# EasyEDA Pro project Batterytester.epro, board PCB1
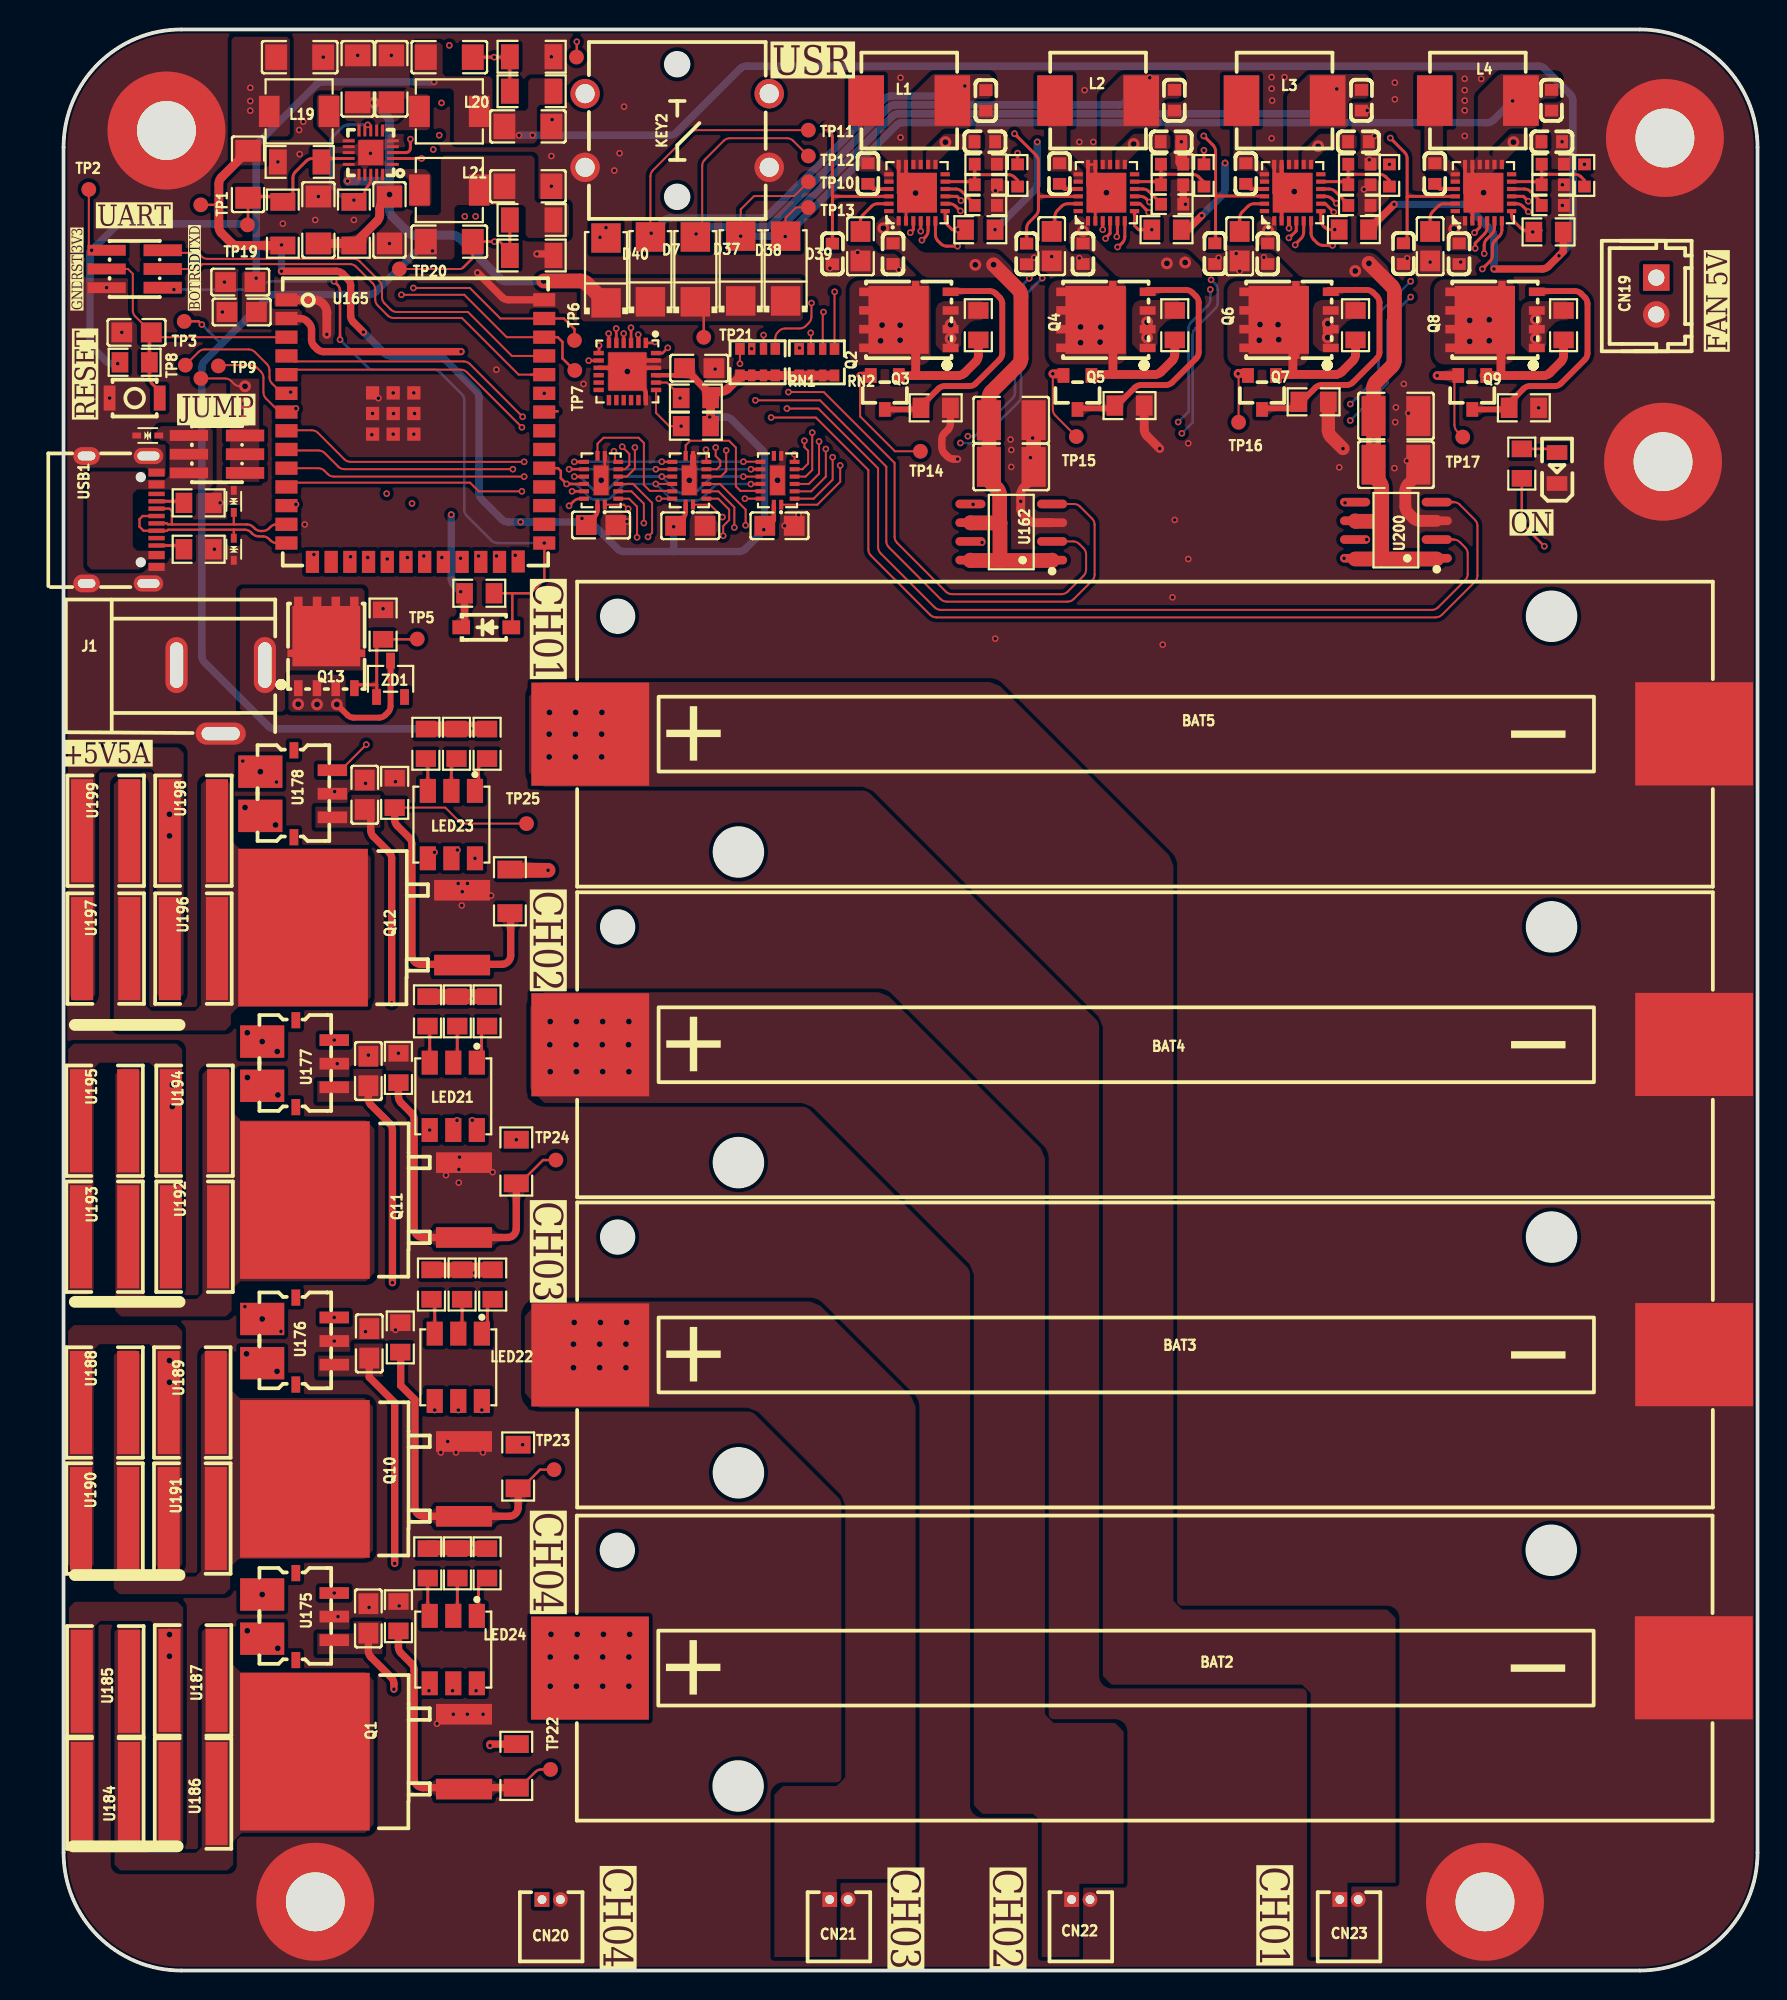
[diagram p1: board, top side]
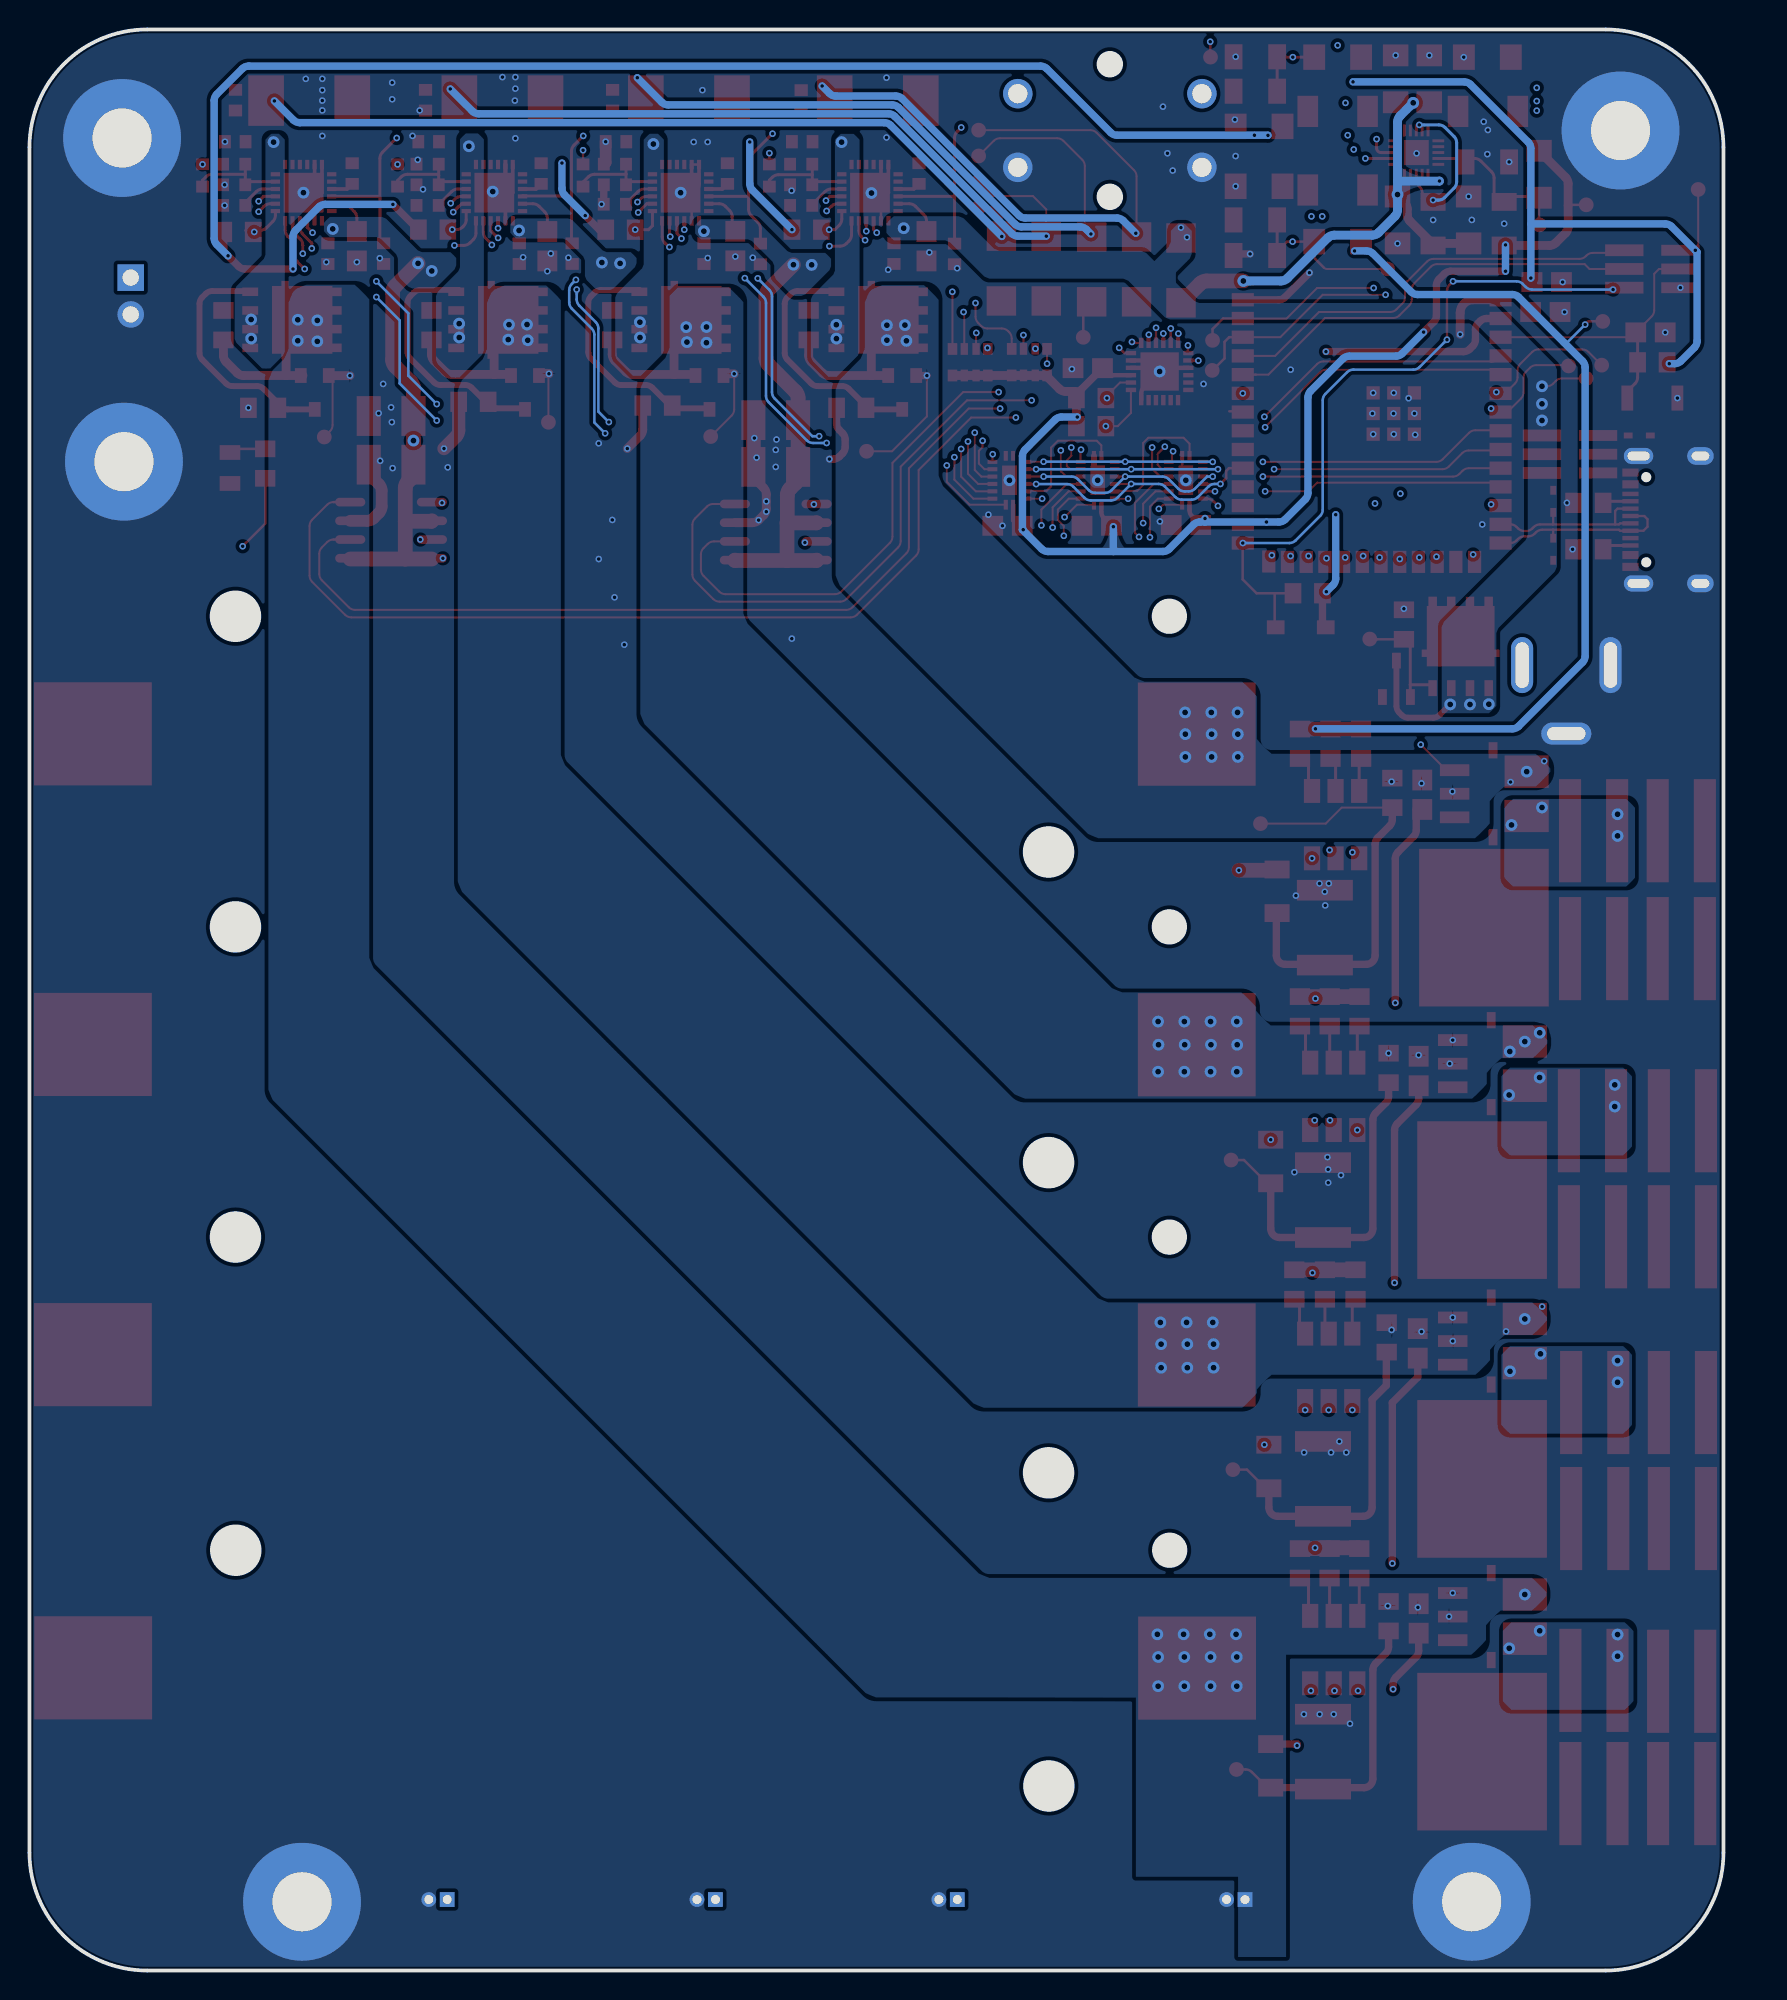
[diagram p2: board, bottom side, seen from below]

Outline 115 x 131.75 mm; copper layers: Top Layer, Inner1, Inner2, Bottom Layer. Coordinates in mm from the lower left corner of the outline.
Outline path: 0,123.75 0,8 arc(2.34,2.34) 8,0 107,0 arc(112.66,2.34) 115,8 115,123.75 arc(112.66,129.4) 107,131.75 8,131.75 arc(2.34,129.4) 0,123.75
Stack: Top Layer 0.035mm Outer layer thickness 1oz / Dielectric1 0.2104mm 7628 RC49% 8.6mil / Inner1 0.0152mm Inner layer thickness / Dielectric2 1.065mm 1.1mm H/HOZ Copper / Inner2 0.0152mm Inner layer thickness / Dielectric3 0.2104mm 7628 RC49% 8.6mil / Bottom Layer 0.035mm Outer layer thickness 1oz

## Design rules (mm)
net USB_D-: DP1
net USB_D+: DP1
template: Custom Config
spacing copperThickness1oz (default): track to track 0.102, other pairs 0.152 to 0.3
spacing copperThickness2oz: track to track 0.152, other pairs 0.152 to 0.3
track width copperThickness1oz (default): min 0.135, default 0.17, max 2.54
track width copperThickness2oz: min 0.135, default 0.17, max 2.54
differential pair differentialPair (default): width min 0.157, default 0.157, max 0.157; gap min 0.203, default 0.203
via viaSize (default): diameter min 0.399, default 0.45, max 10; hole min 0.249, default 0.249, max 6.299

## Placement (name value [footprint] x y rotation side)
BAT2  1042  [BAT-SMD_1042P]  73.39 20.53 180 top
BAT3  1042  [BAT-SMD_1042P]  73.41 41.78 180 top
BAT4  1042  [BAT-SMD_1042P]  73.41 62.84 180 top
BAT5  1042  [BAT-SMD_1042P]  73.41 83.92 180 top
BQ25896  BQ25896RTWR  [QFN-24_L4.0-W4.0-P0.50-TL-EP2.7]  57.94 120.67 90 top
BQ25897  BQ25896RTWR  [QFN-24_L4.0-W4.0-P0.50-TL-EP2.7]  70.8 120.67 90 top
BQ25898  BQ25896RTWR  [QFN-24_L4.0-W4.0-P0.50-TL-EP2.7]  83.44 120.67 90 top
BQ25899  BQ25896RTWR  [QFN-24_L4.0-W4.0-P0.50-TL-EP2.7]  96.39 120.67 90 top
C4  220pF  [C1206]  12.52 121.92 90 top
C5  220pF  [C1206]  26.19 129.87 180 top
C24  47nF  [C0603]  54.61 121.97 90 top
C25  22uF  [C0603]  62.61 126.93 90 top
C26  10uF  [C0603]  62.54 124.13 180 top
C27  1uF  [C0603]  56.31 116.53 90 top
C28  4.7uF  [C0603]  52.2 116.51 270 top
C29  47uF  [C0805]  54.1 117.03 90 top
C247  100nF  [C1210]  64.34 102.05 180 top
C248  10uF  [C1210]  64.34 105.23 180 top
C254  10uF  [C1206]  22.12 118.82 90 top
C257  10uF  [C1206]  17.3 118.82 270 top
C364  47nF  [C0603]  67.62 121.97 90 top
C365  22uF  [C0603]  75.41 126.95 90 top
C366  10uF  [C0603]  75.18 124.13 180 top
C367  1uF  [C0603]  69.21 116.53 90 top
C368  4.7uF  [C0603]  65.38 116.51 270 top
C369  47uF  [C0805]  67.08 117.04 90 top
C370  47nF  [C0603]  80.26 121.97 90 top
C371  22uF  [C0603]  88.11 126.95 90 top
C372  10uF  [C0603]  87.9 124.13 180 top
C373  1uF  [C0603]  81.75 116.53 90 top
C374  4.7uF  [C0603]  78.16 116.53 270 top
C375  47uF  [C0805]  79.84 117.03 90 top
C376  47nF  [C0603]  93.09 121.97 90 top
C377  22uF  [C0603]  101.02 126.95 90 top
C378  10uF  [C0603]  101.03 124.13 180 top
C379  1uF  [C0603]  94.74 116.53 90 top
C380  4.7uF  [C0603]  90.96 116.53 270 top
C381  47uF  [C0805]  92.77 117.03 90 top
C390  10uF  [C1206]  22.25 128.4 270 top
C391  10uF  [C1206]  16.03 129.87 180 top
C392  10uF  [C1206]  31.52 125.17 180 top
C393  10uF  [C1206]  19.97 128.4 270 top
C394  220pF  [C1206]  26.19 117.35 180 top
C395  10uF  [C1206]  31.52 121.1 180 top
C396  100nF  [C0805]  43.15 108.76 180 top
C397  100nF  [C0805]  36.49 98.11 0 top
C398  100nF  [C0805]  20.45 79.8 90 top
C399  100nF  [C0805]  20.69 61.05 270 top
C400  100nF  [C0805]  20.75 42.57 270 top
C401  100nF  [C0805]  20.69 23.9 270 top
C402  100nF  [C0805]  12 114.6 0 top
C403  100nF  [C0805]  4.95 111.19 0 top
C405  100nF  [C0805]  48.6 98.06 0 top
C406  100nF  [C0805]  42.55 98.06 0 top
C407  1uF  [C0805]  12.09 112.57 0 top
C408  100nF  [C1210]  90.45 102.21 180 top
C409  10uF  [C1210]  90.45 105.51 180 top
CN19  ZX-XH2.54-2PZZ  [CONN-TH_2P-P2.50_HX25003-2A]  108.13 113.65 270 top
CN20  HC-1.25-2AW  [CONN-TH_2P-P1.25_HCTL_HC-1.25-2AW]  33.1 4.82 0 top
CN21  HC-1.25-2AW  [CONN-TH_2P-P1.25_HCTL_HC-1.25-2AW]  52.64 4.82 0 top
CN22  HC-1.25-2AW  [CONN-TH_2P-P1.25_HCTL_HC-1.25-2AW]  69.06 4.82 0 top
CN23  HC-1.25-2AW  [CONN-TH_2P-P1.25_HCTL_HC-1.25-2AW]  87.27 4.82 0 top
D7  SS34  [SMA_L4.3-W2.6-LS5.2-RD]  39.84 115.46 90 top
D8  1N4148W-7-F  [SOD-123_L2.7-W1.6-LS3.7-RD-1]  28.7 91.17 0 top
D27  LESD5D5.0CT1G  [SOD-523_L1.2-W0.8-LS1.6-BI]  11.56 99.72 270 top
D28  LESD5D5.0CT1G  [SOD-523_L1.2-W0.8-LS1.6-BI]  5.71 104.19 0 top
D29  LESD5D5.0CT1G  [SOD-523_L1.2-W0.8-LS1.6-BI]  11.56 96.47 90 top
D37  SS34  [SMA_L4.3-W2.6-LS5.2-RD]  42.89 115.46 90 top
D38  SS34  [SMA_L4.3-W2.6-LS5.2-RD]  45.97 115.52 90 top
D39  SS34  [SMA_L4.3-W2.6-LS5.2-RD]  49.02 115.52 90 top
D40  SS34  [SMA_L4.3-W2.6-LS5.2-RD]  36.83 115.39 90 top
J1  DC005-T25  [DC-IN-TH_DC-005-20A-1]  10.67 86.28 0 top
KEY2  B3F-4055  [KEY-TH_4P-L12.0-W12.0-P5.00-LS13.4-EH]  41.66 124.89 0 top
L1  1.5uH  [IND-SMD_L6.5-W6.5_VISHAY]  57.41 126.92 0 top
L2  1.5uH  [IND-SMD_L6.5-W6.5_VISHAY]  70.23 126.92 0 top
L3  1.5uH  [IND-SMD_L6.5-W6.5_VISHAY]  82.89 126.92 0 top
L4  1.5uH  [IND-SMD_L6.5-W6.5_VISHAY]  96.01 126.92 0 top
L19  1.5uH  [IND-SMD_L4.4-W4.2]  15.99 126.18 0 top
L20  1.5uH  [IND-SMD_L4.4-W4.2]  26.19 126.18 180 top
L21  1.5uH  [IND-SMD_L4.4-W4.2]  26.19 120.85 180 top
LED21  HL-AF-5060H271BU46FU79GC-S1-THL  [LED-ARRAY-SMD_6P-L5.4-W5.0-TL-FD]  26.46 59.33 270 top
LED22  HL-AF-5060H271BU46FU79GC-S1-THL  [LED-ARRAY-SMD_6P-L5.4-W5.0-TL-FD]  26.8 40.94 270 top
LED23  HL-AF-5060H271BU46FU79GC-S1-THL  [LED-ARRAY-SMD_6P-L5.4-W5.0-TL-FD]  26.33 77.78 270 top
LED24  HL-AF-5060H271BU46FU79GC-S1-THL  [LED-ARRAY-SMD_6P-L5.4-W5.0-TL-FD]  26.46 21.78 270 top
LED25  NCD0805R1  [LED0805-R-RD]  101.39 101.98 90 top
NOREF  -  [Pad_e204]  108.59 102.41 0 top
NOREF#2  -  [Pad_e203]  108.71 124.38 0 top
NOREF#3  -  [Pad_e202]  17.09 4.67 0 top
NOREF#4  -  [Pad_e206]  96.5 4.67 0 top
NOREF#5  -  [Pad_e200]  6.98 124.89 0 top
Q1  IRLZ44NSTRR-VB  [TO-263-3_L10.2-W9.2-P5.08-LS15.4-BR]  21.78 14.85 0 top
Q2  SI7137DP-T1-GE3  [DFN-8_L5.1-W5.7-P1.27-LS6.1-BL]  57.38 112.04 90 top
Q3  DMP2100U-7  [SOT-23_L2.9-W1.3-P1.90-LS2.4-BR]  55.75 107.11 90 top
Q4  SI7137DP-T1-GE3  [DFN-8_L5.1-W5.7-P1.27-LS6.1-BL]  70.76 112.04 90 top
Q5  DMP2100U-7  [SOT-23_L2.9-W1.3-P1.90-LS2.4-BR]  68.83 107.11 90 top
Q6  SI7137DP-T1-GE3  [DFN-8_L5.1-W5.7-P1.27-LS6.1-BL]  83.19 112.04 90 top
Q7  DMP2100U-7  [SOT-23_L2.9-W1.3-P1.90-LS2.4-BR]  81.36 107.11 90 top
Q8  SI7137DP-T1-GE3  [DFN-8_L5.1-W5.7-P1.27-LS6.1-BL]  97.18 112.04 90 top
Q9  DMP2100U-7  [SOT-23_L2.9-W1.3-P1.90-LS2.4-BR]  95.63 107.11 90 top
Q10  IRLZ44NSTRR-VB  [TO-263-3_L10.2-W9.2-P5.08-LS15.4-BR]  21.78 33.37 0 top
Q11  IRLZ44NSTRR-VB  [TO-263-3_L10.2-W9.2-P5.08-LS15.4-BR]  21.78 52.29 0 top
Q12  IRLZ44NSTRR-VB  [TO-263-3_L10.2-W9.2-P5.08-LS15.4-BR]  21.66 70.78 0 top
Q13  SI7137DP-T1-GE3  [DFN-8_L5.1-W5.7-P1.27-LS6.1-BL]  17.84 89.87 0 top
R23  5.23kΩ  [R0603]  64.77 121.84 90 top
R24  30.1kΩ  [R0603]  62.61 121.2 0 top
R25  NTCG163JF103FT1  [R0603]  62.61 122.6 180 top
R26  124Ω  [R0603]  62.61 119.8 180 top
R194  68kΩ  [R1206]  14.89 118.56 270 top
R195  15kΩ  [R1206]  16.03 122.75 180 top
R196  68kΩ  [R1206]  31.78 127.55 0 top
R197  15kΩ  [R1206]  31.78 129.89 0 top
R280  5.23kΩ  [R0603]  77.42 121.84 90 top
R281  30.1kΩ  [R0603]  75.25 122.6 0 top
R282  NTCG163JF103FT1  [R0603]  75.25 121.2 180 top
R283  124Ω  [R0603]  75.26 119.88 180 top
R285  5.23kΩ  [R0603]  90.01 121.84 90 top
R286  30.1kΩ  [R0603]  87.97 121.2 0 top
R287  NTCG163JF103FT1  [R0603]  87.97 122.6 180 top
R288  124Ω  [R0603]  87.97 119.8 180 top
R290  5.23kΩ  [R0603]  103.25 121.84 90 top
R291  30.1kΩ  [R0603]  101.1 121.2 0 top
R292  NTCG163JF103FT1  [R0603]  101.1 122.6 180 top
R293  124Ω  [R0603]  101.1 119.8 180 top
R320  68kΩ  [R1206]  31.78 118.82 0 top
R321  15kΩ  [R1206]  31.78 116.41 0 top
R322  68kΩ  [R1206]  19.71 118.56 270 top
R324  100kΩ  [R0805]  59.21 106.07 180 top
R325  100kΩ  [R0805]  62.1 111.67 90 top
R326  100kΩ  [R0805]  72.36 106.22 180 top
R327  100kΩ  [R0805]  75.44 111.67 90 top
R328  100kΩ  [R0805]  84.86 106.47 180 top
R329  100kΩ  [R0805]  87.71 111.67 90 top
R330  100kΩ  [R0805]  99.14 106.07 180 top
R331  100kΩ  [R0805]  101.83 111.67 90 top
R337  100kΩ  [R0805]  62.23 118.16 0 top
R338  100kΩ  [R0805]  74.88 118.16 0 top
R339  100kΩ  [R0805]  87.59 118.16 0 top
R340  100kΩ  [R0805]  100.81 118 0 top
R341  100kΩ  [R0805]  22.48 79.93 90 top
R342  100kΩ  [R0805]  22.73 24.05 90 top
R343  100kΩ  [R0805]  22.86 42.97 90 top
R344  100kΩ  [R0805]  22.73 61.26 90 top
R346  100kΩ  [R0805]  4.83 109.15 0 top
R347  100kΩ  [R0805]  28.22 93.48 0 top
R348  300Ω  [R0805]  24.71 65.1 90 top
R349  300Ω  [R0805]  26.73 65.1 90 top
R350  300Ω  [R0805]  28.75 65.1 90 top
R351  300Ω  [R0805]  24.98 46.56 90 top
R352  300Ω  [R0805]  27.05 46.56 90 top
R353  300Ω  [R0805]  29.13 46.56 90 top
R354  300Ω  [R0805]  24.6 83.26 90 top
R355  300Ω  [R0805]  26.67 83.26 90 top
R356  300Ω  [R0805]  28.75 83.26 90 top
R357  300Ω  [R0805]  24.72 27.64 90 top
R358  300Ω  [R0805]  26.74 27.64 90 top
R359  300Ω  [R0805]  28.75 27.64 90 top
R360  5.1kΩ  [R0805]  9.17 99.61 180 top
R361  5.1kΩ  [R0805]  9.17 96.47 180 top
R362  2.2kΩ  [R0805]  42.93 106.73 0 top
R363  2.2kΩ  [R0805]  42.93 104.82 0 top
R364  300Ω  [R0805]  21.69 91.36 270 top
R370  20Ω  [R1206]  30.73 13.89 270 top
R371  20Ω  [R1206]  30.86 34.21 270 top
R372  20Ω  [R1206]  30.73 54.91 270 top
R373  20Ω  [R1206]  30.3 73.25 270 top
R374  1kΩ  [R0805]  99 102.28 270 top
RN1  2.2kΩ  [RES-ARRAY-SMD_0603-8P-L3.2-W1.6-BL]  47.12 109.17 180 top
RN2  2.2kΩ  [RES-ARRAY-SMD_0603-8P-L3.2-W1.6-BL]  51.14 109.16 180 top
SW3  TS-3025-B-C-B  [SW-SMD_L3.0-W2.5-P3.40-LS4.0-L]  4.83 106.73 180 top
TP1  -  [TESTPOINT-SMD_BD2.0-H10.5]  9.31 119.84 0 top
TP2  -  [TESTPOINT-SMD_BD2.0-H10.5]  1.71 120.89 0 top
TP3  -  [TESTPOINT-SMD_BD2.0-H10.5]  8.19 111.93 0 top
TP4  -  [TESTPOINT-SMD_BD2.0-H10.5]  9.32 108.06 0 top
TP5  -  [TESTPOINT-SMD_BD2.0-H10.5]  24.01 90.37 0 top
TP6  -  [TESTPOINT-SMD_BD2.0-H10.5]  34.68 110.64 0 top
TP7  -  [TESTPOINT-SMD_BD2.0-H10.5]  34.71 108.6 0 top
TP8  -  [TESTPOINT-SMD_BD2.0-H10.5]  8.27 108.96 0 top
TP9  -  [TESTPOINT-SMD_BD2.0-H10.5]  10.51 108.91 0 top
TP10  -  [TESTPOINT-SMD_BD2.0-H10.5]  50.56 121.41 0 top
TP11  -  [TESTPOINT-SMD_BD2.0-H10.5]  50.56 124.91 0 top
TP12  -  [TESTPOINT-SMD_BD2.0-H10.5]  50.56 123.16 0 top
TP13  -  [TESTPOINT-SMD_BD2.0-H10.5]  50.56 119.66 0 top
TP14  -  [TESTPOINT-SMD_BD2.0-H10.5]  58.17 103.12 0 top
TP15  -  [TESTPOINT-SMD_BD2.0-H10.5]  68.75 104.12 0 top
TP16  -  [TESTPOINT-SMD_BD2.0-H10.5]  79.77 105.09 0 top
TP17  -  [TESTPOINT-SMD_BD2.0-H10.5]  94.99 104.08 0 top
TP18  -  [TESTPOINT-SMD_BD2.0-H10.5]  34.82 129.87 0 top
TP19  -  [TESTPOINT-SMD_BD2.0-H10.5]  12.49 118.48 0 top
TP20  -  [TESTPOINT-SMD_BD2.0-H10.5]  22.8 115.49 0 top
TP21  -  [TESTPOINT-SMD_BD2.0-H10.5]  43.46 110.85 0 top
TP22  -  [TESTPOINT-SMD_BD2.0-H10.5]  33.06 13.65 0 top
TP23  -  [TESTPOINT-SMD_BD2.0-H10.5]  33.3 34 0 top
TP24  -  [TESTPOINT-SMD_BD2.0-H10.5]  33.42 55.01 0 top
TP25  -  [TESTPOINT-SMD_BD2.0-H10.5]  31.43 77.84 0 top
U9  EA3036CQBR  [WQFN-20_L3.0-W3.0-P0.40-BL-EP]  20.85 123.39 90 top
U162  UCC27524ADR  [SOIC-8_L4.9-W3.9-P1.27-LS6.0-BL]  64.34 97.63 90 top
U165  ESP32-S3-WROOM-1U-N16R8  [WIRELM-SMD_ESP32-S3-WROOM-1U]  23.88 104.5 0 top
U175  ACS781LLRTR-100B-T  [PSOF-7_L6.4-W4.8-BL]  15.93 24.02 90 top
U176  ACS781LLRTR-100B-T  [PSOF-7_L6.4-W4.8-BL]  15.93 42.72 90 top
U177  ACS781LLRTR-100B-T  [PSOF-7_L6.4-W4.8-BL]  15.93 61.55 90 top
U178  ACS781LLRTR-100B-T  [PSOF-7_L6.4-W4.8-BL]  15.8 79.87 90 top
U179  TCA9548ARGER  [VQFN-24_L4.0-W4.0-P0.50-BL-EP2.5]  38.28 108.53 180 top
U181  74HC595BQ,115  [DHVQFN-16_L3.5-W2.5-P0.50-BL-EP]  36.5 101.15 90 top
U182  74HC595BQ,115  [DHVQFN-16_L3.5-W2.5-P0.50-BL-EP]  42.48 101.15 90 top
U183  74HC595BQ,115  [DHVQFN-16_L3.5-W2.5-P0.50-BL-EP]  48.47 101.15 90 top
U184  8Ω  [R1225]  2.84 12.01 180 top
U185  8Ω  [R1225]  2.84 19.63 180 top
U186  8Ω  [R1225]  8.79 12.01 180 top
U187  8Ω  [R1225]  8.79 19.7 180 top
U188  8Ω  [R1225]  2.78 38.55 180 top
U189  8Ω  [R1225]  8.74 38.55 180 top
U190  8Ω  [R1225]  2.78 30.68 180 top
U191  8Ω  [R1225]  8.74 30.68 180 top
U192  8Ω  [R1225]  8.89 49.8 180 top
U193  8Ω  [R1225]  2.78 49.8 180 top
U194  8Ω  [R1225]  8.89 57.68 180 top
U195  8Ω  [R1225]  2.78 57.68 180 top
U196  8Ω  [R1225]  8.81 69.36 180 top
U197  8Ω  [R1225]  2.86 69.36 180 top
U198  8Ω  [R1225]  8.81 77.36 180 top
U199  8Ω  [R1225]  2.86 77.36 180 top
U200  UCC27524ADR  [SOIC-8_L4.9-W3.9-P1.27-LS6.0-BL]  90.45 97.76 90 top
UART1  20021121-00006C4LF  [HDR-SMD_6P-P1.27-V-M-R2-C3-S1.27-LS5.5]  10.41 102.92 270 top
UART2  20021121-00006C4LF  [HDR-SMD_6P-P1.27-V-M-R2-C3-S1.27-LS5.5]  4.83 115.49 270 top
USB1  TYPE-C 16PIN 2MD(073)  [USB-C-SMD_TYPE-C-6PIN-2MD-073]  3.94 98.47 270 top
ZD1  LBZX84C6V2LT1G  [SOT-23-3_L2.9-W1.6-P1.90-LS2.8-BR]  22.2 87.67 270 top

## Footprints (pads in the part's own frame, mm; a bottom-side part is the same pattern mirrored in y, then rotated)
BAT-SMD_1042P
  rect 8x7 smd: 1(-37.28,-0.02) 2(37.66,0)
C0603
  rect 0.8x0.9 smd: 1(-0.7,0) 2(0.7,0)
C0805
  rect 1.41x1.35 smd: 1(-1,0) 2(1,0)
C1206
  rect 1.485x1.728 smd: 1(-1.593,0) 2(1.593,0)
C1210
  rect 1.635x2.7 smd: 1(-1.518,0) 2(1.518,0)
CONN-TH_2P-P1.25_HCTL_HC-1.25-2AW
  rect 1x1 hole 0.6: 1(-0.625,0)
  round 1 hole 0.6: 2(0.625,0)
CONN-TH_2P-P2.50_HX25003-2A
  rect 1.8x1.8 hole 1.1: 1(-1.25,0)
  round 1.8 hole 1.1: 2(1.25,0)
DC-IN-TH_DC-005-20A-1
  oval 1.5x3.8 hole 0.9x3.1: 1(3,2.325) 2(-3,2.325)
  oval 3.4x1.5 hole 2.6x0.9: 3(0,-2.325)
DFN-8_L5.1-W5.7-P1.27-LS6.1-BL
  rect 0.58x1.079 smd: 1(-1.905,-2.834) 2(-0.635,-2.834) 3(0.635,-2.834) 4(1.905,-2.834)
  rect 0.58x1.08 smd: 5(1.9,2.834) 6(0.64,2.834) 7(-0.63,2.834) 8(-1.9,2.834)
  rect 0.95x0.5 smd: 9(-2.169,-0.465) 9(2.169,-0.465)
  rect 4.6x4.1 smd: 9(0,0.695)
DHVQFN-16_L3.5-W2.5-P0.50-BL-EP
  rect 0.665x0.28 smd: 1(-1.657,-0.25) 8(1.657,-0.25) 9(1.657,0.25) 16(-1.657,0.25)
  rect 0.28x0.665 smd: 2(-1.25,-1.157) 3(-0.75,-1.157) 4(-0.25,-1.157) 5(0.25,-1.157) 6(0.75,-1.157) 7(1.25,-1.157) 10(1.25,1.157) 11(0.75,1.157) 12(0.25,1.157) 13(-0.25,1.157) 14(-0.75,1.157) 15(-1.25,1.157)
  rect 2x1 smd: 17(0,0)
HDR-SMD_6P-P1.27-V-M-R2-C3-S1.27-LS5.5
  rect 0.739x2.601 smd: 1(-1.27,-1.905) 3(0,-1.905) 5(1.27,-1.905)
  rect 0.8x2.601 smd: 2(-1.27,1.905) 4(0,1.905) 6(1.27,1.905)
IND-SMD_L4.4-W4.2
  rect 1.4x2.12 smd: 1(2.028,0) 2(-2.028,0)
IND-SMD_L6.5-W6.5_VISHAY
  rect 2.42x3.43 smd: 1(-2.925,0) 2(2.925,0)
KEY-TH_4P-L12.0-W12.0-P5.00-LS13.4-EH
  round 2 hole 1.3: 1(6.25,-2.5) 2(-6.25,-2.5) 3(6.25,2.5) 4(-6.25,2.5)
LED0805-R-RD
  rect 1x1.399 smd: 1(1.05,0) 2(-1.05,0)
LED-ARRAY-SMD_6P-L5.4-W5.0-TL-FD
  rect 1.625x1.1 smd: 1(-2.288,1.6) 2(-2.288,0) 3(-2.288,-1.6) 4(2.288,-1.6) 5(2.288,0) 6(2.288,1.6)
Pad_e200
  round 8 hole 4: 1(0,0)
Pad_e202
  round 8 hole 4: 1(0,0)
Pad_e203
  round 8 hole 4: 1(0,0)
Pad_e204
  round 8 hole 4: 1(0,0)
Pad_e206
  round 8 hole 4: 1(0,0)
PSOF-7_L6.4-W4.8-BL
  rect 0.8x2 smd: 1(-1.601,-2.446) 2(0,-2.446) 3(1.6,-2.446)
  rect 1.1x0.6 smd: 4(2.95,0.164) 7(-2.95,0.164)
  rect 2.2x3 smd: 5(1.5,2.446) 6(-1.5,2.446)
QFN-24_L4.0-W4.0-P0.50-TL-EP2.7
  rect 0.633x0.28 smd: 1(-1.911,1.25) 2(-1.911,0.75) 3(-1.911,0.25) 4(-1.911,-0.25) 5(-1.911,-0.75) 6(-1.911,-1.25) 13(1.911,-1.25) 14(1.911,-0.75) 15(1.911,-0.25) 16(1.911,0.25) 17(1.911,0.75) 18(1.911,1.25)
  rect 0.28x0.633 smd: 7(-1.25,-1.911) 8(-0.75,-1.911) 9(-0.25,-1.911) 10(0.25,-1.911) 11(0.75,-1.911) 12(1.25,-1.911) 19(1.25,1.911) 20(0.75,1.911) 21(0.25,1.911) 22(-0.25,1.911) 23(-0.75,1.911) 24(-1.25,1.911)
  rect 2.7x2.7 smd: 25(0,0)
R0603
  rect 0.806x0.864 smd: 1(-0.753,0) 2(0.753,0)
R0805
  rect 1.133x1.377 smd: 1(-1,0) 2(1,0)
R1206
  rect 1.208x1.701 smd: 1(-1.479,0) 2(1.479,0)
R1225
  rect 1.5x7 smd: 1(-1.6,0) 2(1.6,0)
RES-ARRAY-SMD_0603-8P-L3.2-W1.6-BL
  rect 0.65x0.8 smd: 1(-1.2,-0.9) 4(1.2,-0.9) 5(1.2,0.9) 8(-1.2,0.9)
  rect 0.5x0.8 smd: 2(-0.4,-0.9) 3(0.4,-0.9) 6(0.4,0.9) 7(-0.4,0.9)
SMA_L4.3-W2.6-LS5.2-RD
  rect 2x2 smd: 1(-2.2,0) 2(2.2,0)
SOD-123_L2.7-W1.6-LS3.7-RD-1
  rect 1.2x0.95 smd: 1(-1.7,0) 2(1.7,0)
SOD-523_L1.2-W0.8-LS1.6-BI
  rect 0.6x0.4 smd: 1(-0.75,0) 2(0.75,0)
SOIC-8_L4.9-W3.9-P1.27-LS6.0-BL
  oval 0.588x2.045 smd: 1(-1.905,-2.772) 2(-0.635,-2.772) 3(0.635,-2.772) 4(1.905,-2.772) 5(1.905,2.772) 6(0.635,2.772) 7(-0.635,2.772) 8(-1.905,2.772)
SOT-23-3_L2.9-W1.6-P1.90-LS2.8-BR
  rect 1.07x0.6 smd: 1(1.235,-0.95) 2(1.235,0.95) 3(-1.235,0)
SOT-23_L2.9-W1.3-P1.90-LS2.4-BR
  rect 1x0.8 smd: 1(1.15,-0.95) 2(1.15,0.95) 3(-1.15,0)
SW-SMD_L3.0-W2.5-P3.40-LS4.0-L
  rect 0.8x1.7 smd: 1(-1.7,0) 2(1.7,0)
TESTPOINT-SMD_BD2.0-H10.5
  round 1 smd: 1(0,0)
TO-263-3_L10.2-W9.2-P5.08-LS15.4-BR
  rect 3.8x1.4 smd: 1(5.4,-2.54) 3(5.4,2.54)
  rect 8.8x10.7 smd: 2(-5.4,0)
USB-C-SMD_TYPE-C-6PIN-2MD-073
  rect 0.55x1.1 smd: 1(-3.2,2.375) 2(-2.4,2.375) 11(2.4,2.375) 12(3.2,2.375)
  rect 0.3x1.1 smd: 3(-1.75,2.375) 4(-1.25,2.375) 5(-0.75,2.375) 6(-0.25,2.375) 7(0.25,2.375) 8(0.75,2.375) 9(1.25,2.375) 10(1.75,2.375)
  oval 1.1x2 hole 0.6x1.5: 13(-4.325,1.825) 14(4.325,1.825)
  oval 1.2x1.8 hole 0.6x1.2: 13(-4.325,-2.375) 14(4.325,-2.375)
VQFN-24_L4.0-W4.0-P0.50-BL-EP2.5
  rect 0.3x0.7 smd: 1(-1.25,-1.942) 2(-0.75,-1.942) 3(-0.25,-1.942) 4(0.25,-1.942) 5(0.75,-1.942) 6(1.25,-1.942) 13(1.25,1.942) 14(0.75,1.942) 15(0.25,1.942) 16(-0.25,1.942) 17(-0.75,1.942) 18(-1.25,1.942)
  rect 0.7x0.3 smd: 7(1.948,-1.25) 8(1.948,-0.75) 9(1.948,-0.25) 10(1.948,0.25) 11(1.948,0.75) 12(1.948,1.25) 19(-1.948,1.25) 20(-1.948,0.75) 21(-1.948,0.25) 22(-1.948,-0.25) 23(-1.948,-0.75) 24(-1.948,-1.25)
  rect 2.6x2.6 smd: 25(0.001,-0.001)
WIRELM-SMD_ESP32-S3-WROOM-1U
  rect 1.5x0.9 smd: 1(-8.75,8.895) 2(-8.75,7.625) 3(-8.75,6.355) 4(-8.75,5.085) 5(-8.75,3.815) 6(-8.75,2.545) 7(-8.75,1.275) 8(-8.75,0.005) 9(-8.75,-1.265) 10(-8.75,-2.535) 11(-8.75,-3.805) 12(-8.75,-5.075) 13(-8.75,-6.345) 14(-8.75,-7.615) 27(8.75,-7.615) 28(8.75,-6.345) 29(8.75,-5.075) 30(8.75,-3.805) 31(8.75,-2.535) 32(8.75,-1.265) 33(8.75,0.005) 34(8.75,1.275) 35(8.75,2.545) 36(8.75,3.815) 37(8.75,5.085) 38(8.75,6.355) 39(8.75,7.625) 40(8.75,8.895)
  rect 0.9x1.5 smd: 15(-6.985,-8.895) 16(-5.715,-8.895) 17(-4.445,-8.895) 18(-3.175,-8.895) 19(-1.905,-8.895) 20(-0.635,-8.895) 21(0.635,-8.895) 22(1.905,-8.895) 23(3.175,-8.895) 24(4.445,-8.895) 25(5.715,-8.895) 26(6.985,-8.865)
  rect 0.9x0.9 smd: 41(-2.9,2.575) 41(-2.9,1.175) 41(-2.9,-0.225) 41(-1.5,2.575) 41(-1.5,1.175) 41(-1.5,-0.225) 41(-0.1,2.575) 41(-0.1,1.175) 41(-0.1,-0.225)
WQFN-20_L3.0-W3.0-P0.40-BL-EP
  rect 0.2x0.8 smd: 1(-0.8,-1.5) 2(-0.4,-1.5) 3(0,-1.5) 4(0.4,-1.5) 5(0.8,-1.5) 11(0.8,1.5) 12(0.4,1.5) 13(0,1.5) 14(-0.4,1.5) 15(-0.8,1.5)
  rect 0.8x0.2 smd: 6(1.5,-0.8) 7(1.5,-0.4) 8(1.5,0) 9(1.5,0.4) 10(1.5,0.8) 16(-1.5,0.8) 17(-1.5,0.4) 18(-1.5,0.001) 19(-1.5,-0.4) 20(-1.5,-0.8)
  rect 1.7x1.7 smd: 21(0,0)

## Nets
As in the schematic, except:
GND: BAT2.1 BAT3.1 BAT4.1 BAT5.1 BQ25896.2 BQ25896.17 BQ25896.18 BQ25896.25 BQ25897.2 BQ25897.17 BQ25897.18 BQ25897.25 BQ25898.2 BQ25898.17 BQ25898.18 BQ25898.25 BQ25899.2 BQ25899.17 BQ25899.18 BQ25899.25 C25.1 C26.1 C27.1 C28.2 C29.1 C247.1 C248.1 C254.1 C257.1 C365.1 C366.1 C367.1 C368.2 C369.1 C371.1 C372.1 C373.1 C374.2 C375.1 C377.1 C378.1 C379.1 C380.2 C381.1 C390.1 C391.1 C392.1 C393.1 C395.1 C396.1 C397.2 C398.2 C399.1 C400.1 C401.1 C402.1 C403.1 C405.2 C406.2 C407.1 C408.1 C409.1 CN19.2 CN20.2 CN21.2 CN22.2 CN23.2 D27.1 D28.1 D29.1 J1.2 J1.3 KEY2.1 KEY2.2 LED25.2 NOREF.1 NOREF#2.1 NOREF#3.1 NOREF#4.1 NOREF#5.1 Q1.3 Q10.3 Q11.3 Q12.3 R24.2 R25.1 R26.1 R195.2 R197.2 R281.2 R282.1 R283.1 R286.2 R287.1 R288.1 R291.2 R292.1 R293.1 R321.2 R324.1 R326.1 R328.1 R330.1 R341.2 R342.2 R343.2 R344.2 R360.1 R361.1 R364.1 SW3.2 U9.1 U9.4 U9.5 U9.12 U9.13 U9.15 U9.17 U9.21 U162.3 U165.1 U165.40 U165.41 U175.2 U176.2 U177.2 U178.2 U179.9 U179.18 U179.22 U179.23 U179.25 U181.8 U181.17 U182.8 U182.17 U183.8 U183.17 U200.3 UART2.5 USB1.1 USB1.12 USB1.13 USB1.14

Pads without a net: BQ25896 12 24; BQ25897 12 24; BQ25898 12 24; BQ25899 12 24; U165 16 28 29 30 32 33 34; U175 4 7; U176 4 7; U177 4 7; U178 4 7; U179 10 11 12 13 14 15 16 17; U183 9; USB1 3 9; ZD1 2

## Via types
v1: diameter 0.45, hole 0.25, Top Layer to Bottom Layer, 375 vias
v2: diameter 0.8, hole 0.4, Top Layer to Bottom Layer, 120 vias

## Routing (per net, layer and track width the routed paths; a pad name or vN(x,y) marks a point on that pad's centre or on a via; arc(x,y) is an arc through that point)
+3V3A: length 227
  Top Layer w0.17: TP1.1 10.5,119.84 10.54,119.8
  Top Layer w0.3: U183.16 48.22,98.42 48.17,98.42 v1(47.54,97.79) ; U181.16 36.25,99.12 arc(36.2,98.89) 36.07,98.69 C397.1 ; U182.16 42.23,99 arc(42.19,98.77) 42.06,98.57 C406.1 ; U179.21 41.43,108.28 arc(41.66,108.33) 41.85,108.46 C396.2
  Top Layer w0.5: v1(22.33,46.68) 22.33,57.05 arc(22.28,57.28) 22.15,57.47 20.87,58.76 arc(20.74,58.95) 20.69,59.18 C399.2 ; C401.2 20.69,21.7 arc(20.74,21.47) 20.87,21.27 22.25,19.89 arc(22.38,19.69) 22.43,19.46 v1(22.43,19.1) ; v1(14.79,115.34) 18.52,115.34 arc(18.75,115.29) 18.95,115.16 19.31,114.8 arc(19.44,114.6) 19.49,114.37 19.49,112.32 arc(19.53,112.09) 19.66,111.9 v1(20.35,111.21) ; C396.2 43.56,107.35 arc(43.75,107.22) 43.98,107.18 ; C398.1 20.85,78.8 20.85,77.4 arc(20.9,77.17) 21.03,76.97 22.1,75.9 arc(22.23,75.71) 22.28,75.48 v1(22.28,65.68) ; v1(22.48,27.63) 22.48,38.54 20.75,40.27 C400.2
  Top Layer w0.6: R194.2 11.81,117.09 arc(11.58,117.13) 11.39,117.26 10.72,117.93 arc(10.59,118.13) 10.54,118.35 10.54,121.28 arc(10.59,121.51) 10.72,121.7 C4.2 ; 45.91,108.26 45.91,108.18 45.09,107.35 arc(44.89,107.22) 44.66,107.18 43.98,107.18 ; 45.91,108.26 RN2.5 RN2.6 RN2.7 RN2.8 ; 45.91,108.26 RN1.5 ; 43.93,106.27 R363.2
  Inner2 w0.5: 21.51,65.68 21.51,85.85 arc(21.56,86.08) 21.69,86.28 29.43,94.02 30.79,94.02 31.53,94.75 31.53,97.82 v1(31.03,98.32) ; 21.51,65.68 v1(22.28,65.68) ; 21.51,65.68 21.51,46.68 ; 21.51,46.68 v1(22.33,46.68) ; 21.51,46.68 21.51,27.63 ; v1(22.43,19.1) 22.43,22.13 arc(22.38,22.36) 22.25,22.55 21.69,23.12 arc(21.56,23.31) 21.51,23.54 21.51,27.63 ; 21.51,27.63 v1(22.48,27.63)
  Bottom Layer w0.5: 35.19,98.32 35.55,98.32 arc(35.78,98.27) 35.97,98.14 37.62,96.49 arc(37.81,96.36) 38.04,96.31 41.42,96.31 ; 35.19,98.32 v1(35.19,98.56) ; 35.19,98.32 v1(31.03,98.32) 30.18,98.32 arc(29.95,98.36) 29.75,98.49 28.38,99.86 arc(28.25,100.06) 28.21,100.28 28.21,106.77 arc(28.16,107) 28.03,107.2 25.83,109.4 arc(25.64,109.53) 25.41,109.57 22.23,109.57 arc(22,109.62) 21.81,109.75 v1(20.35,111.21) ; v1(43.87,105.44) 44.94,105.44 arc(45.17,105.4) 45.37,105.27 47.41,103.22 arc(47.54,103.03) 47.59,102.8 47.59,97.79 ; 41.42,96.31 45.86,96.31 arc(46.09,96.36) 46.28,96.49 47.59,97.79 ; 41.42,96.31 v1(41.42,98) ; 47.59,97.79 v1(47.54,97.79) ; v1(14.79,115.34) v1(14.79,117.12)
  vias: v1(12.67,127.79) v1(12.67,126.89) v1(12.67,126.23)
+3V3B: length 223.6
  Top Layer w0.135: TP2.1 1.71,116.96 v1(1.91,116.76)
  Top Layer w0.5: U165.2 16.09,112.13 arc(16.32,112.08) 16.51,111.95 16.66,111.8 arc(16.79,111.61) 16.83,111.38 16.83,110.69 arc(16.88,110.46) 17.01,110.26 17.22,110.06 arc(17.41,109.93) 17.64,109.88 v1(26.98,109.88) ; R340.2 101.81,116.67 v1(101.52,116.38) 100.8,115.67 arc(100.61,115.54) 100.38,115.49 v1(97.11,115.49) ; D8.1 27.22,91.39 R347.1 ; v1(90.33,119.88) 88.61,118.16 R339.2 ; R338.2 76.32,118.16 v1(77.27,119.11)
  Inner2 w0.5: v1(90.33,119.88) 87.7,122.5 arc(87.5,122.64) 87.27,122.68 v1(78.85,122.68) 72.92,122.68 arc(72.69,122.73) 72.5,122.86 72.23,123.13 arc(72.03,123.26) 71.81,123.3 67.16,123.3 arc(66.93,123.35) 66.73,123.48 v1(66.1,124.11) ; v1(26.32,98.81) 26.32,108.97 arc(26.37,109.2) 26.5,109.39 v1(26.98,109.88)
  Bottom Layer w0.5: v1(66.1,124.11) 66.1,121.27 arc(66.06,121.04) 65.93,120.85 v1(63.23,118.16) ; v1(78.85,122.68) 78.85,120.94 arc(78.81,120.71) 78.68,120.52 v1(77.27,119.11) ; v1(97.11,115.49) 97.11,117.69 arc(97.06,117.92) 96.93,118.11 95.35,119.7 arc(95.15,119.83) 94.92,119.88 v1(90.33,119.88) ; v1(26.96,93.58) 26.5,94.05 arc(26.37,94.24) 26.32,94.47 v1(26.32,98.81) ; v1(13.07,114.87) 13.07,118.55 ; 13.07,118.55 13.07,123.67 arc(13.12,123.9) 13.25,124.09 17.17,128.01 arc(17.36,128.14) 17.59,128.19 v1(25.15,128.19) ; 13.07,118.55 3.95,118.55 arc(3.72,118.5) 3.52,118.37 v1(1.91,116.76) 1.79,116.64 1.79,110.59 arc(1.84,110.36) 1.96,110.16 2.89,109.24 arc(3.08,109.11) 3.31,109.06 v1(3.68,109.06) ; v1(101.52,116.38) 102.29,117.15 arc(102.42,117.34) 102.46,117.57 102.46,126.92 arc(102.42,127.15) 102.29,127.34 100.55,129.08 arc(100.35,129.21) 100.12,129.26 46.36,129.26 arc(46.13,129.21) 45.93,129.08 41.59,124.74 arc(41.4,124.61) 41.17,124.57 v1(31.84,124.57) 30.93,124.57 v1(30.92,124.56)
+3V3C: length 139.1
  Top Layer w0.17: TP3.1 8.2,111.94 9.16,111.94 v1(9.39,111.72)
  Top Layer w1: R359.2 R358.2 26.79,28.69 ; 26.79,28.69 24.77,28.69 R357.2 ; 26.79,28.69 v1(27.72,28.69) ; R353.2 R352.2 R351.2 ; R354.2 R355.2 R356.2 ; R348.2 R349.2 R350.2
  Inner2 w0.5: v1(27.7,84.28) 27.7,83.96 arc(27.74,83.74) 27.87,83.54 29.26,82.16 arc(29.39,81.96) 29.43,81.73 29.43,74.53 arc(29.39,74.3) 29.26,74.11 27.92,72.77 arc(27.79,72.58) 27.75,72.35 27.75,66.17 arc(27.79,65.94) 27.92,65.74 29.05,64.61 arc(29.18,64.42) 29.23,64.19 29.23,55.81 arc(29.18,55.58) 29.05,55.39 28.08,54.41 arc(27.95,54.22) 27.9,53.99 v1(27.9,47.35) 27.9,46.12 arc(27.95,45.89) 28.08,45.7 29.46,44.32 arc(29.59,44.12) 29.64,43.89 29.64,38.57 arc(29.59,38.34) 29.46,38.15 27.9,36.59 arc(27.77,36.39) 27.72,36.16 v1(27.72,28.69)
  Bottom Layer w0.17: 10.83,110.5 10.6,110.5 v1(9.39,111.72)
  Bottom Layer w0.5: v1(27.7,84.28) 14.33,84.28 arc(14.1,84.32) 13.9,84.45 9.56,88.79 arc(9.43,88.99) 9.39,89.22 9.39,108.81 arc(9.43,109.04) 9.56,109.24 13.9,113.58 arc(14.1,113.71) 14.33,113.76 20.77,113.76 arc(21,113.8) 21.19,113.93 23.8,116.54 arc(23.99,116.67) 24.22,116.71 v1(25.05,116.71)
  vias: v1(27.7,65.97)
+5V_POW: length 116.4
  Top Layer w0.135: TP4.1 10.96,108.06 arc(11.19,108.01) 11.39,107.88 11.56,107.7 arc(11.76,107.57) 11.99,107.53 v2(12.32,107.53)
  Top Layer w0.17: R374.2 99,98.2 v1(100.53,96.67) ; v1(86.93,95.86) U200.8
  Top Layer w0.4: v2(18.55,85.93) 19.27,85.21 arc(19.47,85.08) 19.7,85.04 21.42,85.04 arc(21.65,85.08) 21.84,85.21 22.02,85.39 arc(22.15,85.59) 22.2,85.82 ZD1.3
  Top Layer w1: v2(88.62,115.87) 90.17,114.32 arc(90.3,114.12) 90.35,113.9 90.35,109.31 arc(90.3,109.08) 90.17,108.89 89.11,107.82 arc(88.98,107.63) 88.93,107.4 C409.2 v2(88.93,103.84) C408.2 88.93,101.68 arc(88.98,101.45) 89.11,101.25 89.31,101.05 arc(89.44,100.86) 89.49,100.63 89.49,98.36 ; 89.49,95.8 93.22,95.8 ; 89.49,95.8 89.49,98.36 ; 89.49,95.8 87.68,95.8 ; 63.57,95.7 67.11,95.7 U162.1 ; 63.57,95.7 63.57,98.26 63.55,98.26 ; 63.57,95.7 61.56,95.7 U162.8 ; 63.55,98.26 61.58,98.26 U162.6 ; 63.55,98.26 63.55,100.14 arc(63.51,100.37) 63.38,100.57 63,100.95 arc(62.87,101.14) 62.82,101.37 C247.2 C248.2 62.82,106.74 arc(62.87,106.97) 63,107.16 64.82,108.99 arc(64.95,109.18) 65,109.41 65,113.67 arc(64.95,113.9) 64.82,114.09 v2(63.14,115.78) ; 89.49,98.36 87.71,98.36 U200.6
  Inner2 w0.17: v1(100.53,96.67) 99.71,95.86 v1(86.93,95.86)
  Inner2 w1: CN19.1 106.06,114.9 103.11,111.95 103.11,105.73 101.22,103.84 v2(88.93,103.84)
  vias: v1(36.42,117.64) v1(36.83,118.3) v2(12.32,106.33) v2(12.32,105.21) v2(15.93,85.95) v2(17.21,85.93) v2(55.65,118.26) v2(61.9,115.77) v2(69.22,118.06) v2(74.9,115.87) v2(76.14,115.93) v2(81.76,118.11) v2(87.69,115.35) v2(94.41,118.21)
GND: length 81
  Top Layer w0.17: BQ25897.2 70.05,119.67 arc(70.09,119.9) 70.22,120.09 v2(70.8,120.67) ; 38.52,108.78 v2(38.28,108.53) ; U181.8 36.75,101.15 v2(36.5,101.15) ; 82.69,120.67 BQ25898.25 ; 95.64,120.67 BQ25899.25 ; BQ25897.18 BQ25897.17 ; BQ25896.2 57.19,120.67 BQ25896.25
  Top Layer w0.25: BQ25897.17 70.05,121.67 arc(70.09,121.44) 70.22,121.24 v2(70.8,120.67) 70.15,120.67 arc(69.72,120.84) 69.55,121.27 BQ25897.18 ; BQ25896.17 57.19,120.67 56.69,120.67 BQ25896.18 ; 95.64,120.67 95.14,120.67 BQ25899.18 ; 95.64,120.67 BQ25899.2 ; 95.64,120.67 BQ25899.17 ; BQ25898.2 82.69,120.67 82.19,120.67 BQ25898.18
  Top Layer w0.3: U179.18 39.53,107.03 arc(39.48,107.26) 39.35,107.46 v2(38.28,108.53) 38.28,108.78 U179.9 ; U179.22 38.52,108.78 38.85,109.1 arc(39.04,109.23) 39.27,109.28 U179.23 ; BQ25898.17 82.69,120.67
  Top Layer w0.4: v2(42.48,101.15) 42.73,101.4 U182.8
  Top Layer w0.5: v1(60.69,102.59) 60.43,102.59 arc(60.2,102.63) 60.01,102.76 59.8,102.97 arc(59.67,103.17) 59.62,103.4 59.62,103.92 arc(59.67,104.15) 59.8,104.34 60.03,104.57 arc(60.16,104.77) 60.21,105 R324.1 ; R321.2 33.15,116.51 v1(32.13,116.51) ; R283.1 76.01,121.2 R282.1 ; U165.40 30.19,113.4 arc(29.96,113.44) 29.77,113.57 v1(28.11,115.23)
  Top Layer w0.6: v1(17.87,111.05) 17.87,112.51 arc(17.61,113.14) 16.99,113.4 U165.1 ; v1(74.41,103.3) 73.54,104.17 arc(73.41,104.37) 73.36,104.6 R326.1 ; U162.3 65.92,98.27 arc(65.69,98.32) v1(65.5,98.44) 65.16,98.79 arc(65.03,98.98) 64.98,99.21 v1(64.98,99.72) 64.98,100.2 arc(65.02,100.43) 65.16,100.63 65.68,101.15 arc(65.81,101.35) 65.85,101.58
  Top Layer w0.8: R281.2 75.88,122.73 v1(75.88,124.13) ; U200.3 92.06,98.4 arc(91.83,98.44) 91.64,98.57 91.27,98.94 arc(91.14,99.14) 91.09,99.37 91.09,100.45 arc(91.14,100.68) 91.27,100.88 91.79,101.4 arc(91.92,101.59) 91.97,101.82 C408.1
  Top Layer w0.9: v1(86.86,103.3) 86.04,104.12 arc(85.91,104.32) 85.86,104.55 R328.1
  Top Layer w1: 65.85,101.58 C248.1
  vias: v1(2.92,114.22) v1(3.13,106.73) v1(3.95,111.19) v1(10.24,96.47) v1(10.62,99.61) v1(10.79,112.57) v1(10.92,114.6) v1(14.55,122.75) v1(14.89,118.56) v1(15.99,124.92) v1(16.03,123.28) v1(16.27,125.49) v1(16.38,98.15) v1(17.08,118.82) v1(17.3,120.41) v1(17.63,129.87) v1(18.4,80.02) v1(18.38,42.72) v1(18.58,61.55) v1(18.63,24.02) v1(19.71,118.82) v1(19.97,129.99) v1(20.5,80.58) v1(20.5,43.36) v1(20.69,62.13) v1(20.74,24.64) v1(20.83,123.34) v1(20.93,104.24) v1(20.98,105.69) v1(21.37,106.72) v1(21.69,92.43) v1(22.12,117.22) v1(22.25,129.99) v1(22.38,107.08) v1(22.4,105.68) v1(22.38,104.28) v1(22.53,80.69) v1(22.53,43.48) v1(22.73,62.26) v1(22.78,24.75) v1(23.78,107.08) v1(23.83,105.68) v1(23.78,104.28) v1(25.35,16.75) v1(25.61,35.16) v1(25.96,53.98) v1(26.08,35.91) v1(26.46,17.39) v1(26.64,35.16) v1(26.79,73.78) v1(26.84,54.37) v1(26.83,53.47) v1(26.88,55.21) v1(27.07,73.22) v1(27.03,72.29) v1(27.42,73.78) v1(27.41,17.39) v1(28.47,35.16) v1(28.48,17.39) v1(29.02,72.95) v1(29.13,54.19) v1(29.38,108.66) v1(33.12,129.89) v1(33.17,125.63) v1(33.12,123.15) v1(33.12,121.1) v1(35.3,107.69) v1(37.39,122.17) v1(37.75,123.34) v1(38.05,126.51) v1(38.25,98.35) v1(44.23,108.7) v1(48.95,98.06) v1(49.9,98.81) v1(52.03,115.54) v1(53.91,116.61) v1(56.71,115.44) v1(56.82,128.47) v1(56.82,124.41) v1(63.26,120.8) v1(63.25,90.4) v1(64.29,103.91) v1(64.34,103.21) v1(64.34,102.05) v1(64.98,99.02) v1(65.64,102.69) v1(65.79,104.01) v1(65.9,116.25) v1(67.08,116.33) v1(68.96,124.11) v1(68.95,116.23) v1(69.31,127.63) v1(69.91,124.11) v1(74.62,89.99) v1(75.28,93.2) v1(75.43,98.46) v1(76.17,119.88) v1(76.35,103.66) v1(76.35,95.8) v1(78.41,116.25) v1(79.61,116.54) v1(79.84,115.34) v1(81.49,116.28) v1(82.01,128.51) v1(82.01,127.73) v1(82.05,126.92) v1(82.01,124.36) v1(82.89,128.51) v1(86.6,102.03) v1(88.29,120.9) v1(88.51,126.25) v1(88.64,122.9) v1(89,124.52) v1(90.35,101.97) v1(90.38,128.14) v1(90.38,127.01) v1(90.45,106.1) v1(90.4,105.1) v1(90.99,107.69) v1(91.22,116.22) v1(91.19,102.47) v1(91.3,105.7) v1(92.77,115.96) v1(94.85,115.96) v1(95.12,128.4) v1(95.12,127.63) v1(95.12,126.92) v1(95.12,126.25) v1(95.12,124.52) v1(96.24,128.39) v1(100.14,106.07) v1(101.73,124.13) v1(101.75,121.2) v1(101.75,119.8) v2(48.47,101.15) v2(57.84,120.64) v2(83.55,120.74) v2(96.4,120.67)
VCCI: length 37.3
  Top Layer w0.17: TP21.1 43.46,112.44 arc(43.41,112.67) 43.28,112.87 D37.1
  Top Layer w0.6: 19.57,117.22 19.77,117.22 21.29,118.74 arc(21.42,118.94) 21.46,119.17 21.46,119.56 arc(21.51,119.79) 21.64,119.98 22.06,120.41 C254.2 ; 19.57,117.22 C257.2 ; 19.57,117.22 R322.2
  Top Layer w1: D40.1 35.52,114.5 arc(35.32,114.63) 35.09,114.68 v2(32.59,114.68)
  Bottom Layer w0.6: v1(19.28,121.46) 19.29,121.45 22.13,121.45 ; v2(32.59,114.68) 30.04,114.68 arc(29.81,114.72) 29.61,114.85 26.85,117.61 arc(26.66,117.74) 26.43,117.78 23.83,117.78 arc(23.6,117.83) 23.41,117.96 22.3,119.07 arc(22.17,119.26) 22.13,119.49 v2(22.13,120.54) 22.13,121.45 ; v2(21.06,126.77) 21.95,125.88 arc(22.08,125.68) 22.13,125.45 22.13,121.45
(no net): length 0.9
  Top Layer w0.17: U165.34 32.68,105.83 33.54,105.83
  vias: v1(21.93,100.24) v1(23.65,99.58) v1(25.1,123.6) v1(25.5,124.57) v1(25.66,126.76) v1(26.19,130.67) v1(27.24,119.06) v1(27.97,119.06)
B1: length 56.5
  Top Layer w0.135: v1(44.73,98.65) 43.89,99.49 U182.1
  Inner2 w0.135: v1(44.73,98.65) 42.78,98.65 39.17,95.04 39.17,91.26 35.5,87.59 29.02,87.59 26.27,84.84 26.27,71.02 26.93,70.35 26.93,59.08 27.75,58.26 v1(27.75,57.71)
B2: length 73
  Top Layer w0.135: U182.15 v1(40.41,99.9)
  Inner2 w0.135: v1(40.41,99.9) 40.41,97.35 31.06,88 28.87,88 25.91,85.04 25.91,70.56 26.42,70.05 26.42,58.83 27.24,58.01 27.24,56.69 24.92,54.36 24.92,41.77 arc(24.96,41.54) 25.09,41.35 v1(28.4,38.04)
B3: length 38.4
  Top Layer w0.135: v1(44.78,97.38) 44.78,98.04 45.19,98.45 45.19,99.16 44.45,99.9 U182.2
  Inner2 w0.135: v1(27.93,75.49) 27.93,79.1 27.14,79.89 27.14,84.58 29.33,86.78 36.04,86.78 40.04,90.77 40.04,94.63 42.79,97.38 v1(44.78,97.38)
B4: length 96.1
  Top Layer w0.135: U181.6 38.12,101.9 38.41,102.18 38.41,102.94 v1(37.92,103.42)
  Inner2 w0.135: v1(37.92,103.42) 37.92,100.16 36.06,98.3 36.06,96.87 29.79,90.6 28.05,90.6 23.7,86.24 23.7,77.69 22.9,76.9 22.9,69.75 24,68.65 24,23.24 arc(24.05,23.01) 24.18,22.82 v1(28.01,18.99)
BAT01: length 16.4
  Top Layer w0.135: v1(54.08,108.25) 54.08,105.48 56.44,103.12 TP14.1
  Top Layer w0.5: v1(54.08,108.25) 54.08,108.26 54.8,108.26
  Inner2 w0.5: v2(60.22,110.76) 60.22,109.76 arc(60.17,109.53) 60.04,109.34 59.13,108.43 arc(58.93,108.3) 58.7,108.25 v1(54.08,108.25)
  vias: v2(59.87,124.1) v2(60.22,111.71)
BAT01+: length 8.7
  Top Layer w0.6: R325.1 62.1,109.62 arc(62.06,109.39) 61.93,109.19 61.17,108.43 arc(60.97,108.3) 60.74,108.26 57.84,108.26 ; 57.84,108.26 56.7,108.26 ; 57.84,108.26 57.85,108.26 Q2.9
  vias: v1(12.17,82.09) v1(14.45,80.67) v2(13.36,81.37) v2(32.97,83.92) v2(32.97,82.37) v2(32.99,85.39) v2(34.77,85.39) v2(34.75,83.92) v2(34.75,82.37) v2(36.55,85.39) v2(36.53,83.92) v2(36.53,82.37) v2(55.47,110.61) v2(55.57,111.68) v2(56.79,111.67) v2(56.79,110.66)
BAT02: length 13.8
  Top Layer w0.135: v1(67.16,108.37) 67.16,105.96 arc(67.2,105.73) 67.33,105.54 TP15.1
  Top Layer w0.6: v1(67.16,108.37) 67.77,108.37 67.88,108.26
  Inner2 w0.5: v1(67.16,108.37) 72.09,108.37 arc(72.32,108.42) 72.51,108.55 73.38,109.41 arc(73.51,109.61) 73.55,109.84 v2(73.55,110.84)
  vias: v2(72.64,123.97) v2(73.56,111.88)
BAT02+: length 8.9
  Top Layer w0.6: 71.24,108.33 74.08,108.33 arc(74.31,108.38) 74.5,108.51 75.26,109.27 arc(75.39,109.46) 75.44,109.69 75.44,110.75 ; 71.24,108.33 69.86,108.33 69.78,108.26 ; 71.24,108.33 71.24,109.86 Q4.9
  vias: v2(12.47,63.65) v2(13.48,63.05) v2(14.5,62.38) v2(33.04,64.41) v2(33.01,62.84) v2(33.04,61.01) v2(34.82,64.41) v2(34.79,62.84) v2(34.82,61.01) v2(36.6,64.41) v2(36.57,62.84) v2(36.6,61.01) v2(38.35,62.84) v2(38.38,64.41) v2(38.38,61.01) v2(69.04,111.55) v2(69.04,110.48) v2(70.37,110.53) v2(70.42,111.54)
BAT03: length 11.8
  Top Layer w0.135: v1(79.73,108.38) 79.77,108.34 TP16.1
  Top Layer w0.6: v1(79.73,108.38) 79.76,108.4 80.26,108.4 80.41,108.26
  Inner2 w0.5: v2(85.82,110.84) 85.82,109.84 arc(85.78,109.61) 85.65,109.41 84.79,108.55 arc(84.59,108.42) 84.36,108.38 v1(79.73,108.38)
  vias: v2(85.17,123.82) v2(85.83,111.78)
BAT03+: length 8.7
  Top Layer w0.6: 83.45,109.94 83.45,108.34 83.45,108.33 ; 83.45,108.33 82.31,108.33 ; 83.45,108.33 86.35,108.33 arc(86.58,108.38) 86.77,108.51 87.53,109.27 arc(87.66,109.46) 87.71,109.69 87.71,110.75
  vias: v1(12.31,45.06) v1(14.76,43.38) v2(13.48,44.22) v2(34.67,43.99) v2(34.61,42.52) v2(34.61,40.91) v2(36.45,43.99) v2(36.4,42.52) v2(36.4,40.91) v2(38.23,43.99) v2(38.18,42.52) v2(38.18,40.91) v2(81.22,111.72) v2(81.17,110.65) v2(82.45,111.71) v2(82.5,110.69)
BAT04: length 14.3
  Top Layer w0.135: 94.67,108.25 94.42,108 94.42,104.9 arc(94.47,104.67) 94.6,104.47 TP17.1
  Top Layer w0.6: 94.68,108.26 94.67,108.25 v1(93.25,108.25)
  Inner2 w0.5: v2(99.95,110.76) 99.95,109.76 arc(99.9,109.53) 99.77,109.34 98.86,108.43 arc(98.66,108.3) 98.43,108.25 v1(93.25,108.25)
  vias: v2(98.43,124.1) v2(99.95,112.06)
BAT04+: length 8.7
  Top Layer w0.6: 97.57,108.26 100.47,108.26 arc(100.7,108.3) 100.9,108.43 101.66,109.19 arc(101.79,109.39) 101.83,109.62 R331.1 ; 97.57,108.26 97.58,108.26 97.58,109.87 ; 97.57,108.26 96.43,108.26
  vias: v2(13.48,25.52) v2(33.04,21.28) v2(33.04,19.3) v2(33.09,22.82) v2(34.87,22.82) v2(34.82,21.28) v2(34.82,19.3) v2(36.65,22.82) v2(36.6,21.28) v2(36.6,19.3) v2(38.43,22.82) v2(38.38,21.28) v2(38.38,19.3) v2(95.46,112) v2(95.46,110.58) v2(96.79,112.04) v2(96.79,110.62)
BOOT: length 89.7
  Top Layer w0.17: D8.2 30.47,91.24 30.47,93.48 ; 30.47,93.48 31.7,93.48 32.64,94.42 32.64,96.88 v1(32.63,96.89) ; 30.47,93.48 R347.2 ; v1(18.77,110.69) 18.77,114 arc(18.72,114.23) 18.59,114.42 v1(18.36,114.65)
  Inner2 w0.135: 39.72,127.39 39.75,127.35 39.75,123.03 arc(39.71,122.8) 39.58,122.6 31.8,114.83 arc(31.61,114.7) 31.38,114.65 v1(18.36,114.65) ; 39.72,127.39 KEY2.3 ; 39.72,127.39 KEY2.4
  Bottom Layer w0.17: v1(18.77,110.69) 20.62,108.83 arc(20.82,108.7) 21.05,108.66 25.13,108.66 arc(25.36,108.61) 25.55,108.48 27.03,107 arc(27.16,106.81) 27.2,106.58 27.2,99.15 arc(27.25,98.92) 27.38,98.73 29.04,97.06 arc(29.24,96.93) 29.47,96.89 v1(32.63,96.89) ; v1(7.49,114.09) 13,114.09 arc(13.23,114.14) 13.42,114.27 13.63,114.48 arc(13.82,114.61) 14.05,114.65 v1(18.36,114.65)
BTST1: length 1.6
  Top Layer w0.24: BQ25896.21 54.96,120.92 C24.1
BTST2: length 1.4
  Top Layer w0.254: C364.1 67.96,120.92 68.88,120.92
BTST3: length 1.4
  Top Layer w0.254: 81.53,120.92 80.61,120.92 C370.1
BTST4: length 1.5
  Top Layer w0.254: BQ25899.21 93.44,120.92 C376.1
CC1: length 1.8
  Top Layer w0.203: 8.14,99.74 8.12,99.72 USB1.4
CC2: length 1.8
  Top Layer w0.203: 8.14,96.69 8.12,96.72 USB1.10
CE1: length 37.9
  Top Layer w0.135: U183.1 51.17,99.49 52.72,101.04 v1(52.72,102.15)
  Top Layer w0.203: BQ25896.9 60.65,120.42 60.93,120.14
  Inner2 w0.135: v1(52.72,102.15) 54.07,103.5 arc(54.27,103.63) 54.5,103.68 v1(60.88,103.68) ; v1(60.93,120.13) 61.27,119.79 arc(61.4,119.59) 61.44,119.37 61.44,118.94 arc(61.49,118.71) 61.62,118.52 62.8,117.33 arc(63,117.2) 63.23,117.16 63.9,117.16 arc(64.13,117.11) 64.32,116.98 v1(66.44,114.87)
  Bottom Layer w0.17: v1(66.44,114.87) 65.17,113.61 arc(65.04,113.41) 65,113.18 65,106.87 arc(64.95,106.64) 64.82,106.45 62.23,103.85 arc(62.03,103.72) 61.8,103.68 v1(60.88,103.68)
CE2: length 52
  Top Layer w0.135: U183.3 50.75,100.4 51.75,101.39 v1(51.75,103.27)
  Top Layer w0.203: v1(73.72,120.03) 73.51,120.24 arc(73.32,120.37) 73.09,120.42 BQ25897.9
  Inner2 w0.135: v1(77.9,114.75) 74.49,114.75 arc(74.26,114.8) 74.07,114.93 73.86,115.14 arc(73.73,115.33) 73.69,115.56 73.69,116.25 arc(73.73,116.48) 73.86,116.68 74.65,117.46 arc(74.78,117.66) 74.82,117.89 74.82,118.69 arc(74.78,118.92) 74.65,119.11 v1(73.72,120.03) ; v1(51.75,103.27) 53.21,104.73 74.01,104.73 74.4,104.34 v1(75.92,104.34)
  Bottom Layer w0.17: v1(77.9,114.75) 78.18,114.47 arc(78.31,114.28) 78.36,114.05 78.36,113.22 arc(78.31,112.99) 78.18,112.8 76.83,111.44 arc(76.7,111.25) 76.65,111.02 76.65,105.07 v1(75.92,104.34)
CE3: length 60.4
  Top Layer w0.135: U183.6 50.16,101.9 50.55,102.28 50.55,103.15 50.29,103.4 v1(50.29,103.83)
  Top Layer w0.203: v1(86.4,119.95) 86.11,120.24 arc(85.92,120.37) 85.69,120.42 BQ25898.9
  Inner2 w0.135: v1(91.45,114.65) 90.65,114.65 90.12,115.18 90.12,116.23 v1(86.4,119.95) ; v1(50.29,103.83) 50.29,104.63 51.62,105.95 86.98,105.95 v1(87.35,106.32)
  Bottom Layer w0.17: v1(91.45,114.65) 89.28,112.48 89.28,108.25 v1(87.35,106.32)
CE4: length 63.8
  Top Layer w0.135: v1(49.61,102.92) 49.63,102.9 U183.7
  Top Layer w0.203: v1(99.44,120.09) 99.11,120.42 BQ25899.9
  Inner2 w0.135: v1(99.44,120.09) 100.88,118.64 100.88,116.71 98.33,114.16 96.41,114.16 93.7,111.45 89.79,111.45 84.75,106.41 51.36,106.41 49.61,104.66 v1(49.61,102.92)
EE: length 11.2
  Top Layer w0.17: U9.8 20.85,125.06 v1(20.65,125.27)
  Top Layer w0.18: R322.1 20.27,120.04 20.45,120.22 20.45,120.65 arc(20.49,120.88) 20.62,121.08 20.68,121.13 arc(20.81,121.33) 20.85,121.56 U9.18
  Top Layer w0.2: v1(19.71,120.16) R322.1
  Bottom Layer w0.203: v1(20.65,125.27) 19.32,125.27 arc(19.09,125.22) 18.9,125.09 18.29,124.48 arc(18.16,124.29) 18.11,124.06 18.11,121.4 arc(18.16,121.17) 18.29,120.98 18.92,120.34 arc(19.12,120.21) 19.35,120.16 v1(19.71,120.16)
FB1: length 11.3
  Top Layer w0.17: TP19.1 12.52,118.52 C4.1
  Top Layer w0.203: U9.14 16.89,122.99 arc(16.66,122.94) 16.47,122.81 15.75,122.09 arc(15.62,121.9) 15.57,121.67 15.57,120.04 15.13,120.04 arc(14.9,120.09) 14.71,120.22 14.7,120.23 arc(14.5,120.36) 14.27,120.41 12.57,120.41
  Top Layer w0.254: 17.74,122.99 R195.1
FB2: length 23.6
  Top Layer w0.17: v1(34.84,130.91) 34.84,129.89 TP18.1
  Top Layer w0.203: U9.3 23.24,123.39 arc(23.46,123.48) 23.55,123.69 v1(23.55,124.3) ; R196.1 30.3,129.87 ; 30.3,129.87 v1(29.23,129.87) C5.1 ; 30.3,129.87 R197.1
  Inner2 w0.135: v1(23.55,124.3) 23.55,127.1 arc(23.59,127.33) 23.72,127.53 25.89,129.69 arc(26.08,129.82) 26.31,129.87 v1(29.23,129.87) 30.2,129.87 arc(30.43,129.91) 30.62,130.04 31.32,130.74 arc(31.51,130.87) 31.74,130.91 v1(34.84,130.91)
FB3: length 22.4
  Top Layer w0.135: TP20.1 26.91,115.49 arc(27.03,115.51) 27.12,115.58
  Top Layer w0.17: 27.12,115.58 27.69,116.15 arc(27.76,116.25) 27.78,116.36 C394.1 v1(29.25,117.35) 29.62,117.35 30.3,116.66
  Top Layer w0.203: U9.2 v1(24.31,122.99) ; R320.1 R321.1
  Inner2 w0.135: v1(29.25,117.35) 29.25,119.83 arc(29.2,120.05) 29.07,120.25 26.51,122.81 arc(26.31,122.94) 26.08,122.99 v1(24.31,122.99)
G1: length 51.2
  Top Layer w0.135: U181.2 38.39,99.9 38.93,99.36 v1(38.93,97.28)
  Inner2 w0.135: v1(38.93,97.28) 30.57,88.92 28.62,88.92 24.92,85.22 24.92,76.45 24.43,75.96 24.43,70.61 25.93,69.11 25.93,58.49 v1(26.71,57.71)
G2: length 73.2
  Top Layer w0.135: v1(39.4,98.24) 39.4,99.56 38.56,100.4 U181.3
  Inner2 w0.135: v1(26.8,38.04) 24.79,40.05 arc(24.66,40.25) 24.61,40.48 24.61,54.75 25.37,55.51 25.37,69.09 24.03,70.44 24.03,76.22 24.61,76.81 24.61,85.48 28.46,89.33 30.35,89.33 37.59,96.57 37.59,97.08 38.31,97.79 38.94,97.79 v1(39.4,98.24)
G3: length 38.9
  Top Layer w0.135: v1(45.54,97.94) 45.54,99.31 44.45,100.4 U182.3
  Inner2 w0.135: v1(45.54,97.94) 45.53,97.94 42.65,97.94 39.63,94.92 39.63,91.11 35.7,87.18 29.18,87.18 26.73,84.74 26.73,76.06 v1(26.74,76.05)
G4: length 93.8
  Top Layer w0.135: U181.7 37.44,102.4 37.44,103.04 v1(37.36,103.12)
  Inner2 w0.135: v1(26.41,18.99) 23.87,21.52 arc(23.74,21.71) 23.7,21.94 23.7,68.39 22.55,69.54 22.55,77.14 23.36,77.96 23.36,86.42 27.95,91.01 29.58,91.01 34.68,96.11 34.68,98.76 35.45,99.53 35.45,101.21 v1(37.36,103.12)
G201: length 16.9
  Top Layer w0.4: Q3.3 57.73,105.96 arc(57.96,106) 58.16,106.13 59.39,107.36 arc(59.58,107.49) 59.81,107.54 61.5,107.54 arc(61.73,107.59) 61.92,107.72 63.55,109.35 arc(63.68,109.54) 63.73,109.77 63.73,113.13 arc(63.68,113.36) 63.55,113.56 63.29,113.82 arc(63.1,113.95) 62.87,113.99 60.27,113.99 Q2.4
G202: length 16.9
  Top Layer w0.4: 73.55,114.01 73.6,114.06 76.21,114.06 arc(76.43,114.02) 76.63,113.89 76.89,113.63 arc(77.02,113.44) 77.06,113.21 77.06,109.84 arc(77.02,109.61) 76.89,109.42 75.26,107.79 arc(75.06,107.66) 74.83,107.61 73.15,107.61 arc(72.92,107.57) 72.72,107.44 71.49,106.21 arc(71.3,106.08) 71.07,106.03 69.09,106.03
G203: length 16.9
  Top Layer w0.4: 85.82,114.02 85.87,114.07 88.48,114.07 arc(88.71,114.02) 88.9,113.89 89.16,113.63 arc(89.29,113.44) 89.34,113.21 89.34,109.84 arc(89.29,109.62) 89.16,109.42 87.53,107.79 arc(87.33,107.66) 87.11,107.61 85.42,107.61 arc(85.19,107.57) 84.99,107.44 83.76,106.21 arc(83.57,106.08) 83.34,106.03 81.36,106.03
G204: length 16.9
  Top Layer w0.4: 99.95,113.94 100,113.99 102.6,113.99 arc(102.83,113.95) 103.02,113.82 103.28,113.56 arc(103.41,113.36) 103.46,113.13 103.46,109.77 arc(103.41,109.54) 103.28,109.35 101.65,107.72 arc(101.46,107.59) 101.23,107.54 99.54,107.54 arc(99.31,107.49) 99.12,107.36 97.89,106.13 arc(97.69,106) 97.46,105.96 95.48,105.96
GA: length 30.2
  Top Layer w0.135: R341.1 25.92,78.93 27,77.84 TP25.1
  Top Layer w0.5: R373.2 30.35,71.72 30.35,68.89 arc(30.18,68.47) 29.75,68.29 24.25,68.29 arc(23.82,68.47) 23.65,68.89 23.65,76.46 arc(23.6,76.69) 23.47,76.88 22.65,77.7 arc(22.52,77.89) 22.48,78.12 R341.1
GB: length 24.3
  Top Layer w0.17: R372.2 30.97,53.43 32.55,55.01 TP24.1
  Top Layer w0.5: R344.1 22.73,59.32 arc(22.78,59.1) 22.91,58.9 23.62,58.19 arc(23.75,57.99) 23.8,57.76 23.8,50.35 arc(23.98,49.93) 24.4,49.75 Q11.1 30.13,49.75 arc(30.56,49.93) 30.73,50.35 R372.2
GC: length 22.9
  Top Layer w0.17: TP23.1 32.35,34 31.08,32.73 R371.2
  Top Layer w0.5: R371.2 30.86,31.43 arc(30.69,31.01) 30.26,30.83 Q10.1 24.45,30.83 arc(24.03,31.01) 23.85,31.43 23.85,38.75 22.89,39.71 22.89,41.97 R343.1
GD: length 20.6
  Top Layer w0.17: TP22.1 32.44,13.65 arc(32.21,13.6) 32.02,13.47 30.96,12.41 R370.2
  Top Layer w0.5: 27.18,12.41 Q1.1 ; 27.18,12.41 R370.2 ; 27.18,12.41 24.4,12.41 arc(23.98,12.59) 23.8,13.01 23.8,20.4 arc(23.75,20.63) 23.62,20.82 22.91,21.54 arc(22.78,21.73) 22.73,21.96 R342.1
GIN: length 8.7
  Top Layer w0.17: 24.11,90.73 23.91,90.53 arc(23.72,90.4) 23.49,90.36 R364.2
  Top Layer w0.203: R364.2 21.26,90.36 21.26,87.27 ; 21.26,87.27 19.74,87.27 19.74,87.04 ; 21.26,87.27 21.26,86.44 ZD1.1
I2C_SCL: length 33.5
  Top Layer w0.135: 15.47,108.66 26.95,108.66 arc(27.18,108.61) 27.38,108.48 v1(31.11,104.75) ; v1(41.93,104.82) 41.12,104.82 40.22,105.72 U179.19
  Top Layer w0.17: U165.5 15.47,108.66
  Inner2 w0.135: v1(41.93,104.82) 41.42,105.33 arc(41.22,105.46) 40.99,105.51 35.48,105.51 arc(35.25,105.46) 35.05,105.33 33.63,103.91 arc(33.43,103.78) 33.2,103.73 32.38,103.73 arc(32.15,103.78) 31.96,103.91 v1(31.11,104.75)
I2C_SCL1: length 33
  Top Layer w0.135: RN2.1 52.34,113.93 v1(52.35,113.94)
  Top Layer w0.17: U179.8 36.32,109.27 v1(35.65,109.27)
  Top Layer w0.203: 58.29,117.45 58.52,117.67 arc(58.65,117.86) 58.69,118.09 BQ25896.5
  Inner2 w0.135: v1(35.65,109.27) 35.65,110.96 arc(35.69,111.19) 35.82,111.39 38.17,113.73 arc(38.37,113.86) 38.59,113.91 52.32,113.91 v1(52.35,113.94) ; v1(58.27,117.45) 57.53,116.71 arc(57.34,116.58) 57.11,116.53 55.19,116.53 arc(54.96,116.49) 54.76,116.36 52.53,114.12 arc(52.43,114.04) 52.33,113.99
I2C_SCL2: length 42.2
  Top Layer w0.135: RN2.2 51.54,112.52 v1(51.59,112.57)
  Top Layer w0.17: v1(37,111.11) 37.03,111.09 U179.6
  Top Layer w0.203: v1(71.5,117.68) 71.55,117.73 BQ25897.5
  Inner2 w0.135: v1(37,111.11) 37,111.4 arc(37.05,111.63) 37.18,111.83 38.37,113.02 arc(38.57,113.15) 38.8,113.19 49.28,113.19 arc(49.51,113.15) 49.7,113.02 49.98,112.74 arc(50.17,112.61) 50.4,112.57 v1(51.59,112.57) 52.1,112.57 arc(52.33,112.61) 52.53,112.74 54.01,114.23 arc(54.2,114.36) 54.43,114.4 67.99,114.4 arc(68.22,114.45) 68.41,114.58 71.5,117.66 v1(71.5,117.68)
I2C_SCL3: length 53.3
  Top Layer w0.135: RN2.3 50.74,111.14 v1(50.72,111.15)
  Top Layer w0.17: U179.4 v1(38.03,111.11)
  Top Layer w0.203: BQ25898.5 84.19,117.99 arc(84.14,117.76) 84.01,117.56 83.59,117.14
  Inner2 w0.135: v1(38.03,111.11) 38.03,111.41 arc(38.07,111.64) 38.2,111.83 38.62,112.25 arc(38.82,112.38) 39.05,112.43 44.89,112.43 arc(45.12,112.38) 45.31,112.25 46.85,110.72 arc(47.04,110.59) 47.27,110.54 47.85,110.54 arc(48.08,110.59) 48.27,110.72 48.53,110.98 arc(48.73,111.11) 48.95,111.15 v1(50.72,111.15) 51.91,111.15 arc(52.14,111.2) 52.33,111.33 54.47,113.46 arc(54.66,113.59) 54.89,113.64 79.88,113.64 arc(80.11,113.69) 80.3,113.82 v1(83.61,117.12)
I2C_SCL4: length 64.9
  Top Layer w0.17: U179.2 39.03,111.01 v1(39.01,111.03)
  Top Layer w0.203: v1(96.44,116.53) 96.44,117.1 arc(96.49,117.33) 96.62,117.52 96.97,117.87 arc(97.1,118.06) 97.14,118.29 BQ25899.5
  Inner2 w0.135: 49.95,109.52 49.96,109.54 v1(49.96,110.13) ; 49.95,109.52 46.51,109.52 arc(46.28,109.57) 46.09,109.7 44.45,111.34 arc(44.25,111.47) 44.02,111.51 39.74,111.51 arc(39.51,111.47) 39.32,111.34 v1(39.01,111.03) ; 49.95,109.52 51.49,109.52 arc(51.72,109.57) 51.92,109.7 54.97,112.75 arc(55.16,112.88) 55.39,112.92 92.84,112.92 v1(96.44,116.53)
I2C_SDA: length 32.1
  Top Layer w0.135: U179.20 40.97,107.78 41.93,106.82 R362.1 ; v1(31.17,105.46) 27.58,109.04 arc(27.39,109.17) 27.16,109.22 15.75,109.22
  Top Layer w0.17: U165.4 15.33,109.39 arc(15.52,109.26) 15.75,109.22
  Inner2 w0.135: v1(41.85,106.73) 41.22,106.09 arc(41.02,105.96) 40.79,105.91 35.33,105.91 arc(35.1,105.87) 34.9,105.74 33.47,104.31 arc(33.28,104.18) 33.05,104.14 32.73,104.14 arc(32.51,104.18) 32.31,104.31 v1(31.17,105.46)
I2C_SDA1: length 36.1
  Top Layer w0.135: RN1.1 48.32,110.78 arc(48.36,111.01) 48.49,111.2 48.57,111.28 arc(48.76,111.41) 48.99,111.45 49.97,111.45 arc(50.2,111.5) 50.39,111.63 50.6,111.83 arc(50.73,112.03) 50.77,112.26 v1(50.77,113.18)
  Top Layer w0.17: v1(36.35,110.3) 36.35,109.81 U179.7
  Top Layer w0.203: BQ25896.6 59.19,117.81 arc(59.24,117.58) 59.37,117.39 59.54,117.22 arc(59.73,117.08) 59.96,117.04 60.63,117.04
  Inner2 w0.135: v1(36.35,110.3) 36.35,111.16 arc(36.4,111.39) 36.53,111.58 38.32,113.38 arc(38.52,113.51) 38.75,113.55 50.15,113.55 arc(50.38,113.51) 50.58,113.38 50.6,113.35 arc(50.69,113.28) 50.79,113.22 arc(50.91,113.19) 51.02,113.18 52.05,113.18 arc(52.28,113.22) 52.47,113.35 55.07,115.95 arc(55.26,116.08) 55.49,116.12 57.44,116.12 arc(57.66,116.17) 57.86,116.3 58.42,116.86 arc(58.62,116.99) 58.85,117.04 v1(60.7,117.04)
